# EAGLE schematic HFT-Core-Module_1V1 (EAGLE 7.7.0), part 2 of 2
## Sheet 25 of 37: I2C1 - LiPo charger
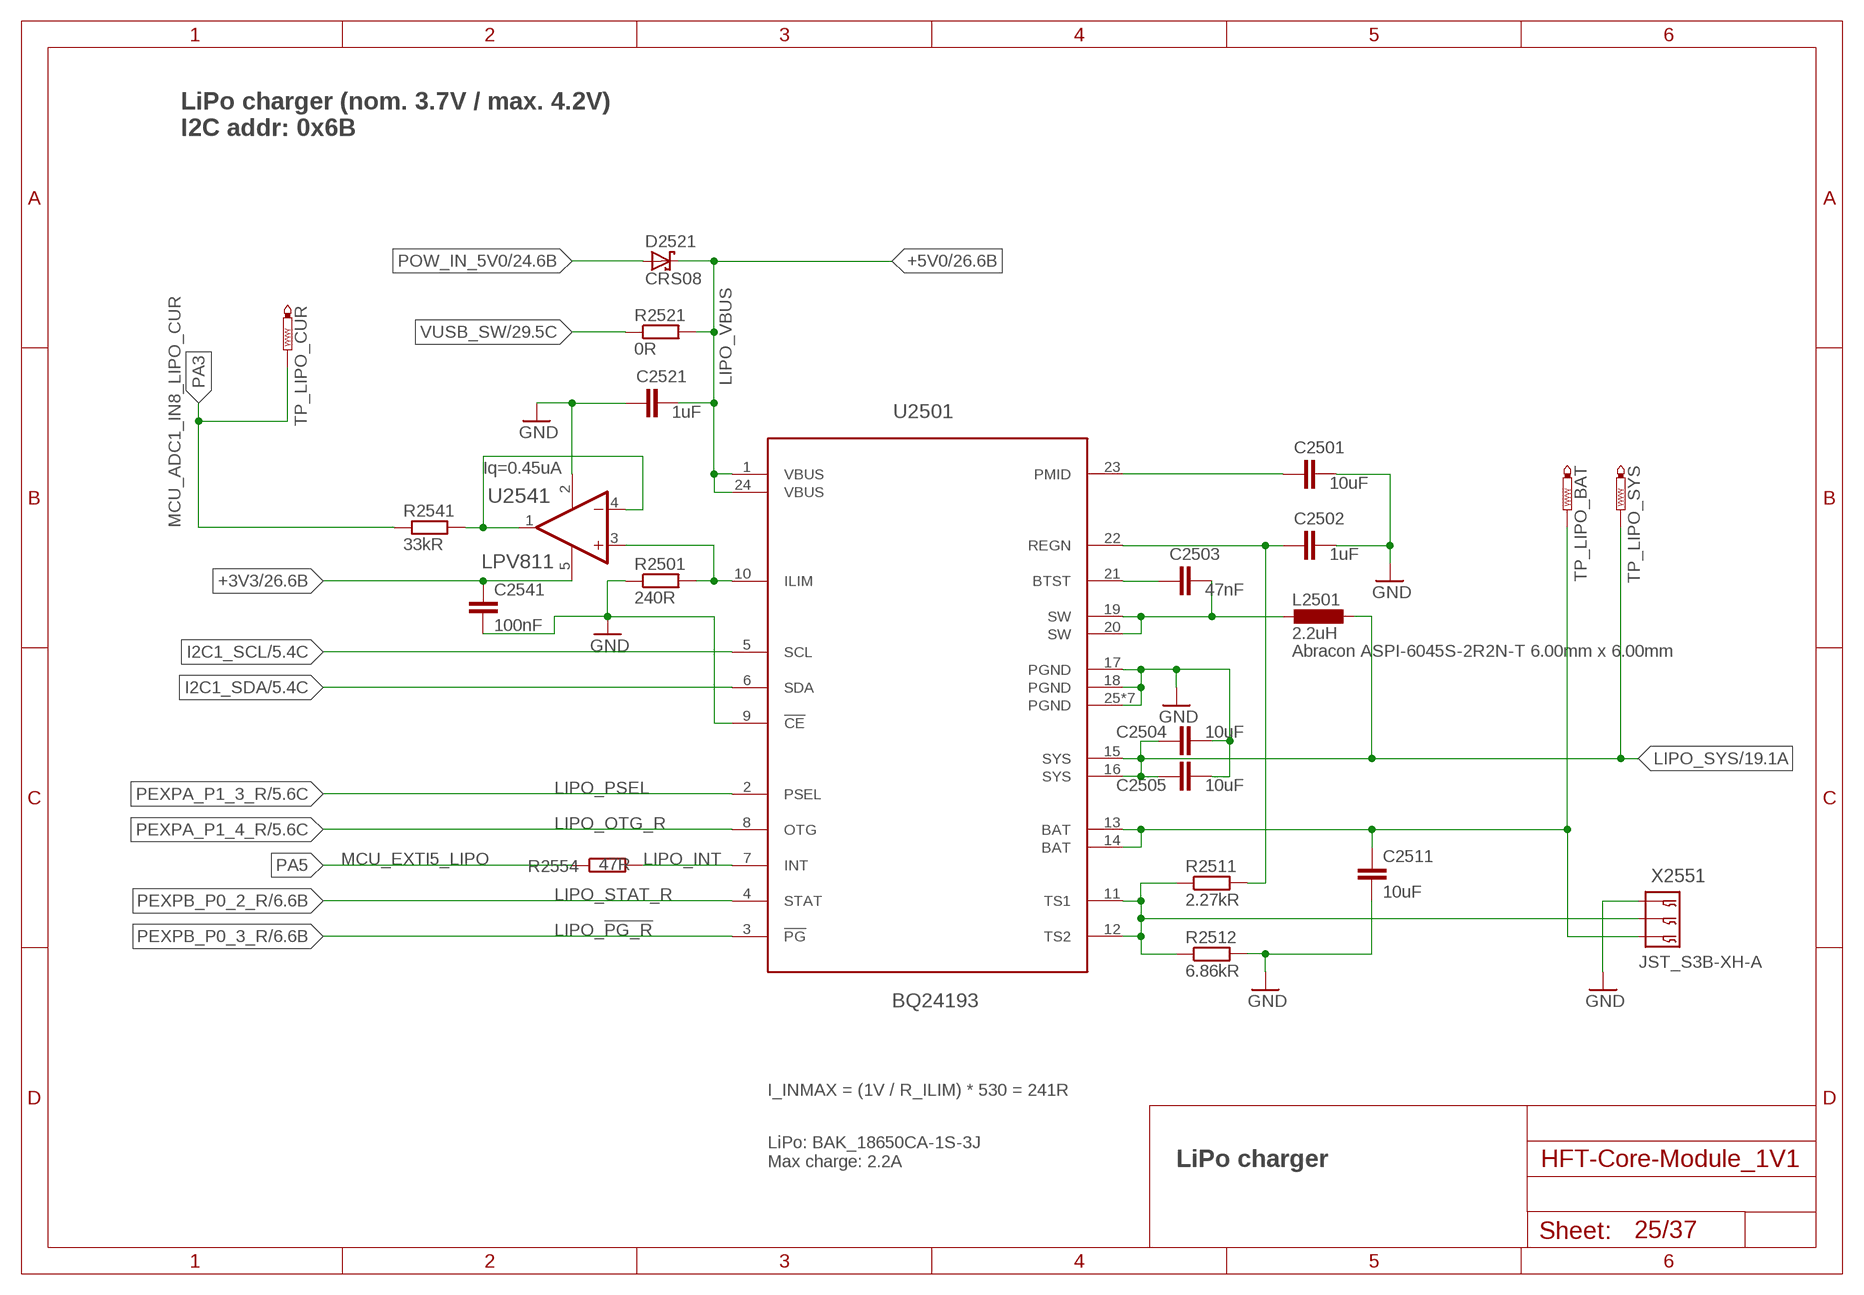
[diagram p24: schematic, sheet 25]

### Parts
C2501  10uF  C-EUC0402  [C0402]
C2502  1uF  C-EUC0402  [C0402]
C2503  47nF  C-EUC0402  [C0402]
C2504  10uF  C-EUC0402  [C0402]
C2505  10uF  C-EUC0402  [C0402]
C2511  10uF  C-EUC0402  [C0402]
C2521  1uF  C-EUC0402  [C0402]
C2541  100nF  C-EUC0402  [C0402]
D2521  CRS08  [SOD80C]
L2501  2.2uH  L-EU6.00X6.00MM  [L_6.00MM_X_6.00MM]
R2501  240R  R-EU_R0402  [R0402]
R2511  2.27kR  R-EU_R0402  [R0402]
R2512  6.86kR  R-EU_R0402  [R0402]
R2521  0R  R-EU_R0402  [R0402]
R2541  33kR  R-EU_R0402  [R0402]
R2554  47R  R-EU_R0402  [R0402]
TP_LIPO_BAT  PTR1B1,27  [B1,27]
TP_LIPO_CUR  PTR1B1,27  [B1,27]
TP_LIPO_SYS  PTR1B1,27  [B1,27]
U2501  BQ24193  [VQFN-24]
U2541  LPV811  [SOT-23-5]
X2551  JST_S3B-XH-A  [JST_S3B-XH-A]

### Nets
+3V3: C2541.1 U2541.5(V+) ; also sheet 2,4,5,6,7,8,9,10,11,13,14,15,22,23,26,27,28,30,31,34,36
+5V0 [pwrA5]: C2521.2 D2521.C R2521.2 U2501.1(VBUS) U2501.24(VBUS) ; also sheet 26,27,36
GND: C2501.2 C2502.2 C2504.2 C2505.2 C2511.2 C2521.1 C2541.2 R2501.1 R2512.2 U2501.9(!CE) U2501.17(PGND) U2501.18(PGND) U2501.25(PGND) U2501.26(PGND) U2501.P$1(PGND) U2501.P$2(PGND) U2501.P$3(PGND) U2501.P$4(PGND) U2501.P$5(PGND) U2541.2(V-) X2551.3 ; also sheet 1,2,3,4,5,6,7,8,9,10,11,12,13,14,15,16,17,18,19,21,22,23,24,26,27,28,29,30,31,32,33,34,35,36,37
I2C1_SCL: U2501.5(SCL) ; also sheet 5,6,8,10,14,15,16,17,18
I2C1_SDA: U2501.6(SDA) ; also sheet 5,6,8,10,14,15,16,17,18
LIPO_ADC_CUR_IN_LOOP: R2541.2 U2541.1(OUT) U2541.4(-IN)
LIPO_BAT: C2511.1 TP_LIPO_BAT.TP U2501.13(BAT) U2501.14(BAT) X2551.1
LIPO_BTST: C2503.1 U2501.21(BTST)
LIPO_ILIM: R2501.2 U2501.10(ILIM) U2541.3(+IN)
LIPO_INT: R2554.2 U2501.7(INT)
LIPO_PMID: C2501.1 U2501.23(PMID)
LIPO_REGN: C2502.1 R2511.2 U2501.22(REGN)
LIPO_SW: C2503.2 L2501.2 U2501.19(SW) U2501.20(SW)
LIPO_SYS: C2504.1 C2505.1 L2501.1 TP_LIPO_SYS.TP U2501.15(SYS) U2501.16(SYS) ; also sheet 19
LIPO_TS12: R2511.1 R2512.1 U2501.11(TS1) U2501.12(TS2) X2551.2
PA3: R2541.1 TP_LIPO_CUR.TP ; also sheet 1
PA5: R2554.1 ; also sheet 1
PEXPA_P1_3_R: U2501.2(PSEL) ; also sheet 5
PEXPA_P1_4_R: U2501.8(OTG) ; also sheet 5
PEXPB_P0_2_R: U2501.4(STAT) ; also sheet 6
PEXPB_P0_3_R: U2501.3(!PG) ; also sheet 6
POW_IN_5V0: D2521.A ; also sheet 24
VUSB_SW [pwrA5]: R2521.1 ; also sheet 29

### Notes on the sheet
- LiPo charger (nom. 3.7V / max. 4.2V)
  I2C addr: 0x6B
- LIPO_VBUS
- Iq=0.45uA
- MCU_ADC1_IN8_LIPO_CUR
- Abracon ASPI-6045S-2R2N-T 6.00mm x 6.00mm
- LIPO_PSEL
- LIPO_OTG_R
- MCU_EXTI5_LIPO
- LIPO_STAT_R
- LIPO_!PG_R
- I_INMAX = (1V / R_ILIM) * 530 = 241R
- LiPo: BAK_18650CA-1S-3J
  Max charge: 2.2A
- LiPo charger

## Sheet 26 of 37: ADC1/TIMCAP - Solar Power Harvesting
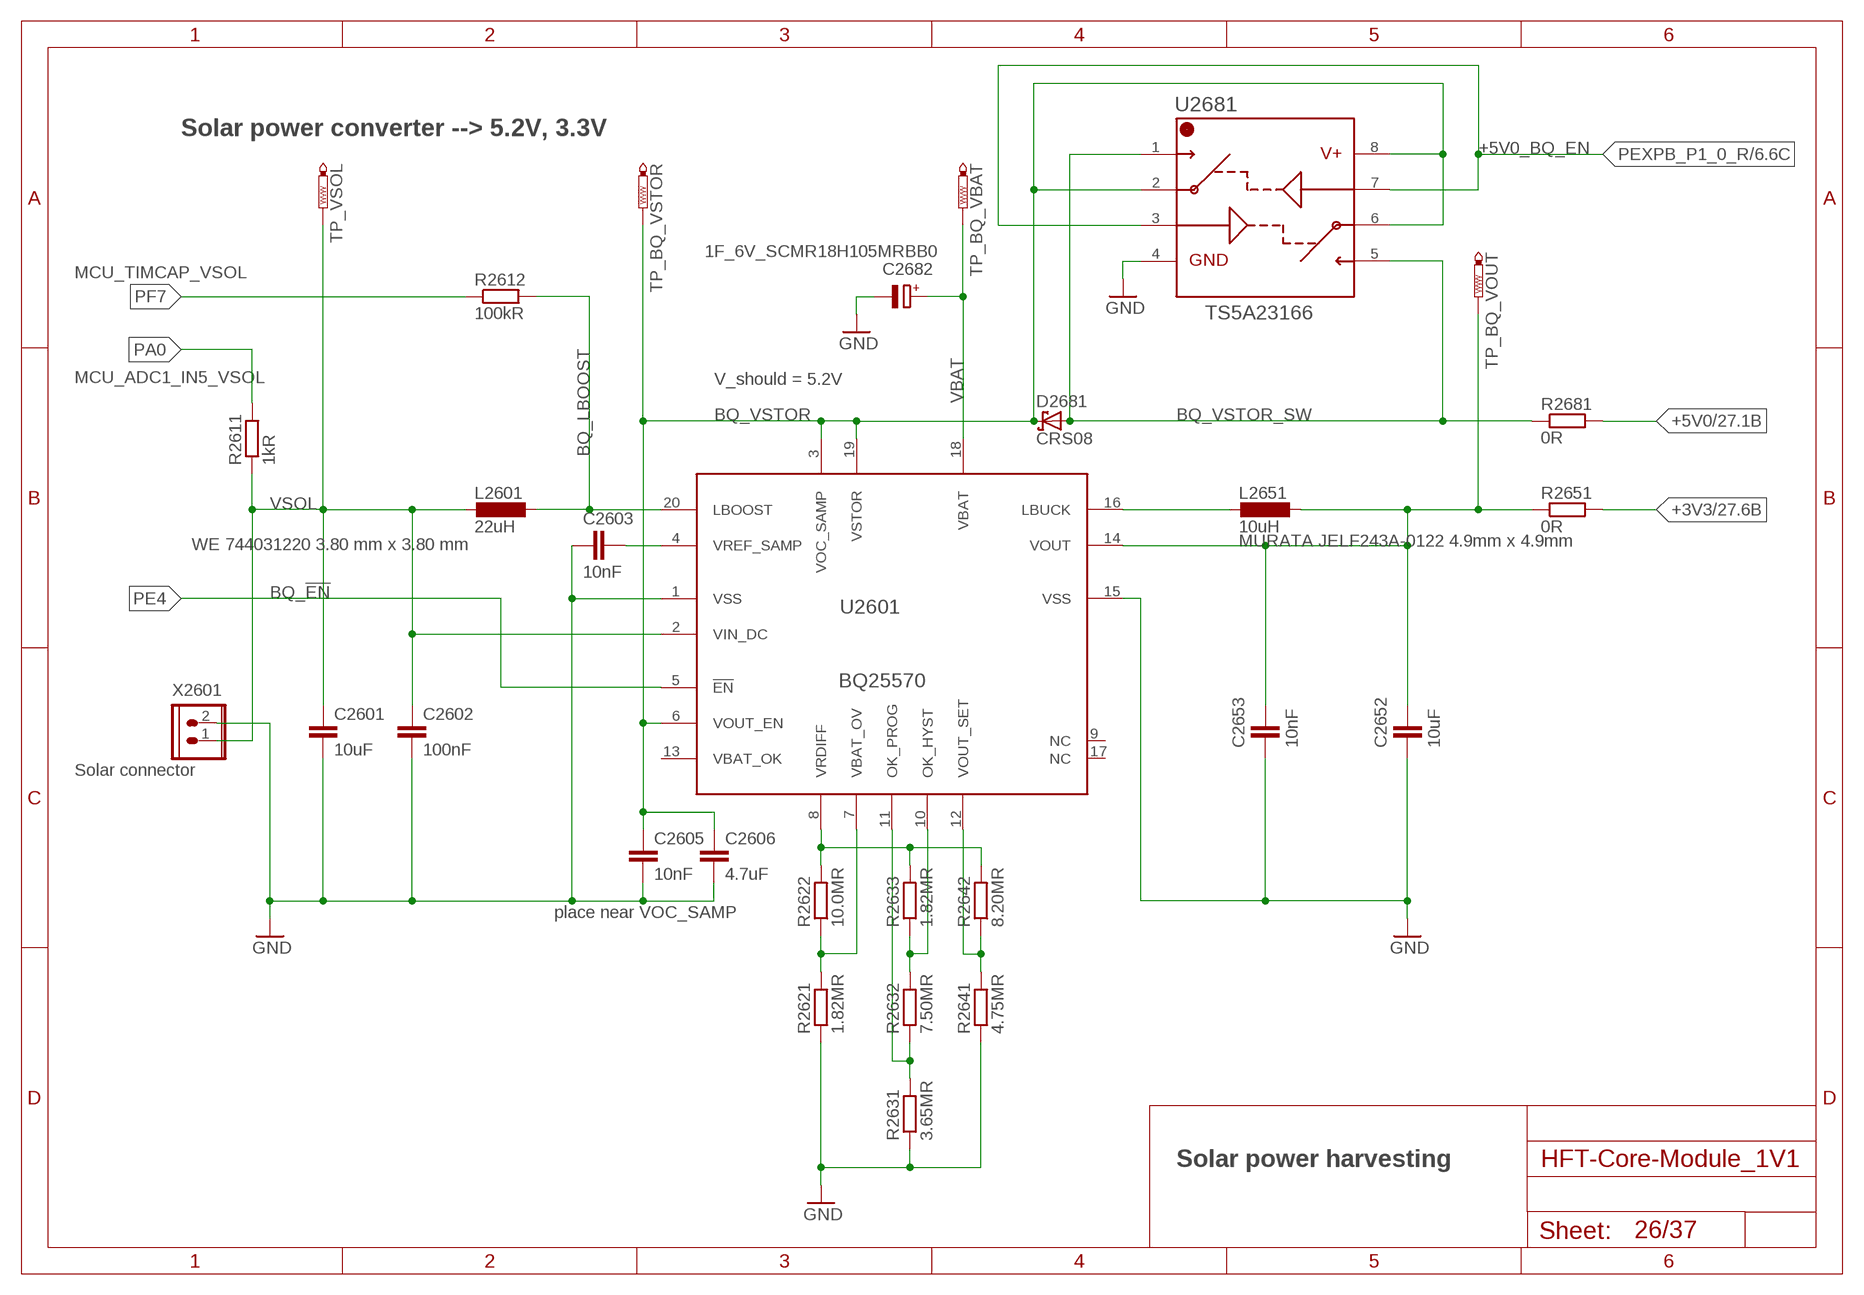
[diagram p25: schematic, sheet 26]

### Parts
C2601  10uF  C-EUC0402  [C0402]
C2602  100nF  C-EUC0402  [C0402]
C2603  10nF  C-EUC0402  [C0402]
C2605  10nF  C-EUC0402  [C0402]
C2606  4.7uF  C-EUC0402  [C0402]
C2652  10uF  C-EUC0402  [C0402]
C2653  10nF  C-EUC0402  [C0402]
C2682  1F_6V_SCMR18H105MRBB0  CPOL-EUC115-080X160_POL  [C115-080X160_POL]
D2681  CRS08  [SOD80C]
L2601  22uH  L-EUWE-TPCWE_TPC_3MM8  [WE-TPC_3MM8-3MM8_R-1MM3]
L2651  10uH  L-EU4.90X4.90MM  [L_4.90MM_X_4.90MM]
R2611  1kR  R-EU_R0402  [R0402]
R2612  100kR  R-EU_R0402  [R0402]
R2621  1.82MR  R-EU_R0402  [R0402]
R2622  10.0MR  R-EU_R0402  [R0402]
R2631  3.65MR  R-EU_R0402  [R0402]
R2632  7.50MR  R-EU_R0402  [R0402]
R2633  1.82MR  R-EU_R0402  [R0402]
R2641  4.75MR  R-EU_R0402  [R0402]
R2642  8.20MR  R-EU_R0402  [R0402]
R2651  0R  R-EU_R0402  [R0402]
R2681  0R  R-EU_R0402  [R0402]
TP_BQ_VBAT  PTR1B1,27  [B1,27]
TP_BQ_VOUT  PTR1B1,27  [B1,27]
TP_BQ_VSTOR  PTR1B1,27  [B1,27]
TP_VSOL  PTR1B1,27  [B1,27]
U2601  BQ25570  [V-PVQFN-20]
U2681  TS5A23166  [R-PDSO-G8]
X2601  WIRE-TO-BOARD_5MM08_1X02  [WIRE-TO-BOARD_5MM08_1X02]

### Nets
+3V3: R2651.2 ; also sheet 2,4,5,6,7,8,9,10,11,13,14,15,22,23,25,27,28,30,31,34,36
+5V0 [pwrA5]: R2681.2 ; also sheet 25,27,36
BQ_LBOOST: L2601.1 R2612.2 U2601.20(LBOOST)
BQ_LBUCK: L2651.2 U2601.16(LBUCK)
BQ_OK_HYST: R2632.2 R2633.1 U2601.10(OK_HYST)
BQ_OK_PROG: R2631.2 R2632.1 U2601.11(OK_PROG)
BQ_VBAT_OV: R2621.2 R2622.1 U2601.7(VBAT_OV)
BQ_VOUT: C2652.1 C2653.1 L2651.1 R2651.1 TP_BQ_VOUT.TP U2601.14(VOUT)
BQ_VOUT_SET: R2641.2 R2642.1 U2601.12(VOUT_SET)
BQ_VRDIFF: R2622.2 R2633.2 R2642.2 U2601.8(VRDIFF)
BQ_VREF_SAMP: C2603.2 U2601.4(VREF_SAMP)
BQ_VSTOR: C2605.1 C2606.1 D2681.C TP_BQ_VSTOR.TP U2601.3(VOC_SAMP) U2601.6(VOUT_EN) U2601.19(VSTOR) U2681.2 U2681.6 U2681.8
BQ_VSTOR_SW: D2681.A R2681.1 U2681.1 U2681.5
GND: C2601.2 C2602.2 C2603.1 C2605.2 C2606.2 C2652.2 C2653.2 C2682.- R2621.1 R2631.1 R2641.1 U2601.1(VSS) U2601.15(VSS) U2681.4 X2601.2 ; also sheet 1,2,3,4,5,6,7,8,9,10,11,12,13,14,15,16,17,18,19,21,22,23,24,25,27,28,29,30,31,32,33,34,35,36,37
PA0: R2611.2 ; also sheet 1
PE4: U2601.5(!EN) ; also sheet 1
PEXPB_P1_0_R: U2681.3 U2681.7 ; also sheet 6
PF7: R2612.1 ; also sheet 1
VBAT: C2682.+ TP_BQ_VBAT.TP U2601.18(VBAT)
VSOL: C2601.1 C2602.1 L2601.2 R2611.1 TP_VSOL.TP U2601.2(VIN_DC) X2601.1
Unconnected: U2601.9(NC) U2601.13(VBAT_OK) U2601.17(NC)

### Notes on the sheet
- Solar power converter --> 5.2V, 3.3V
- +5V0_BQ_EN
- MCU_TIMCAP_VSOL
- MCU_ADC1_IN5_VSOL | V_should = 5.2V
- WE 744031220 3.80 mm x 3.80 mm | MURATA JELF243A-0122 4.9mm x 4.9mm
- BQ_!EN
- Solar connector
- place near VOC_SAMP
- Solar power harvesting

## Sheet 27 of 37: PMIC 5V --> 3V3
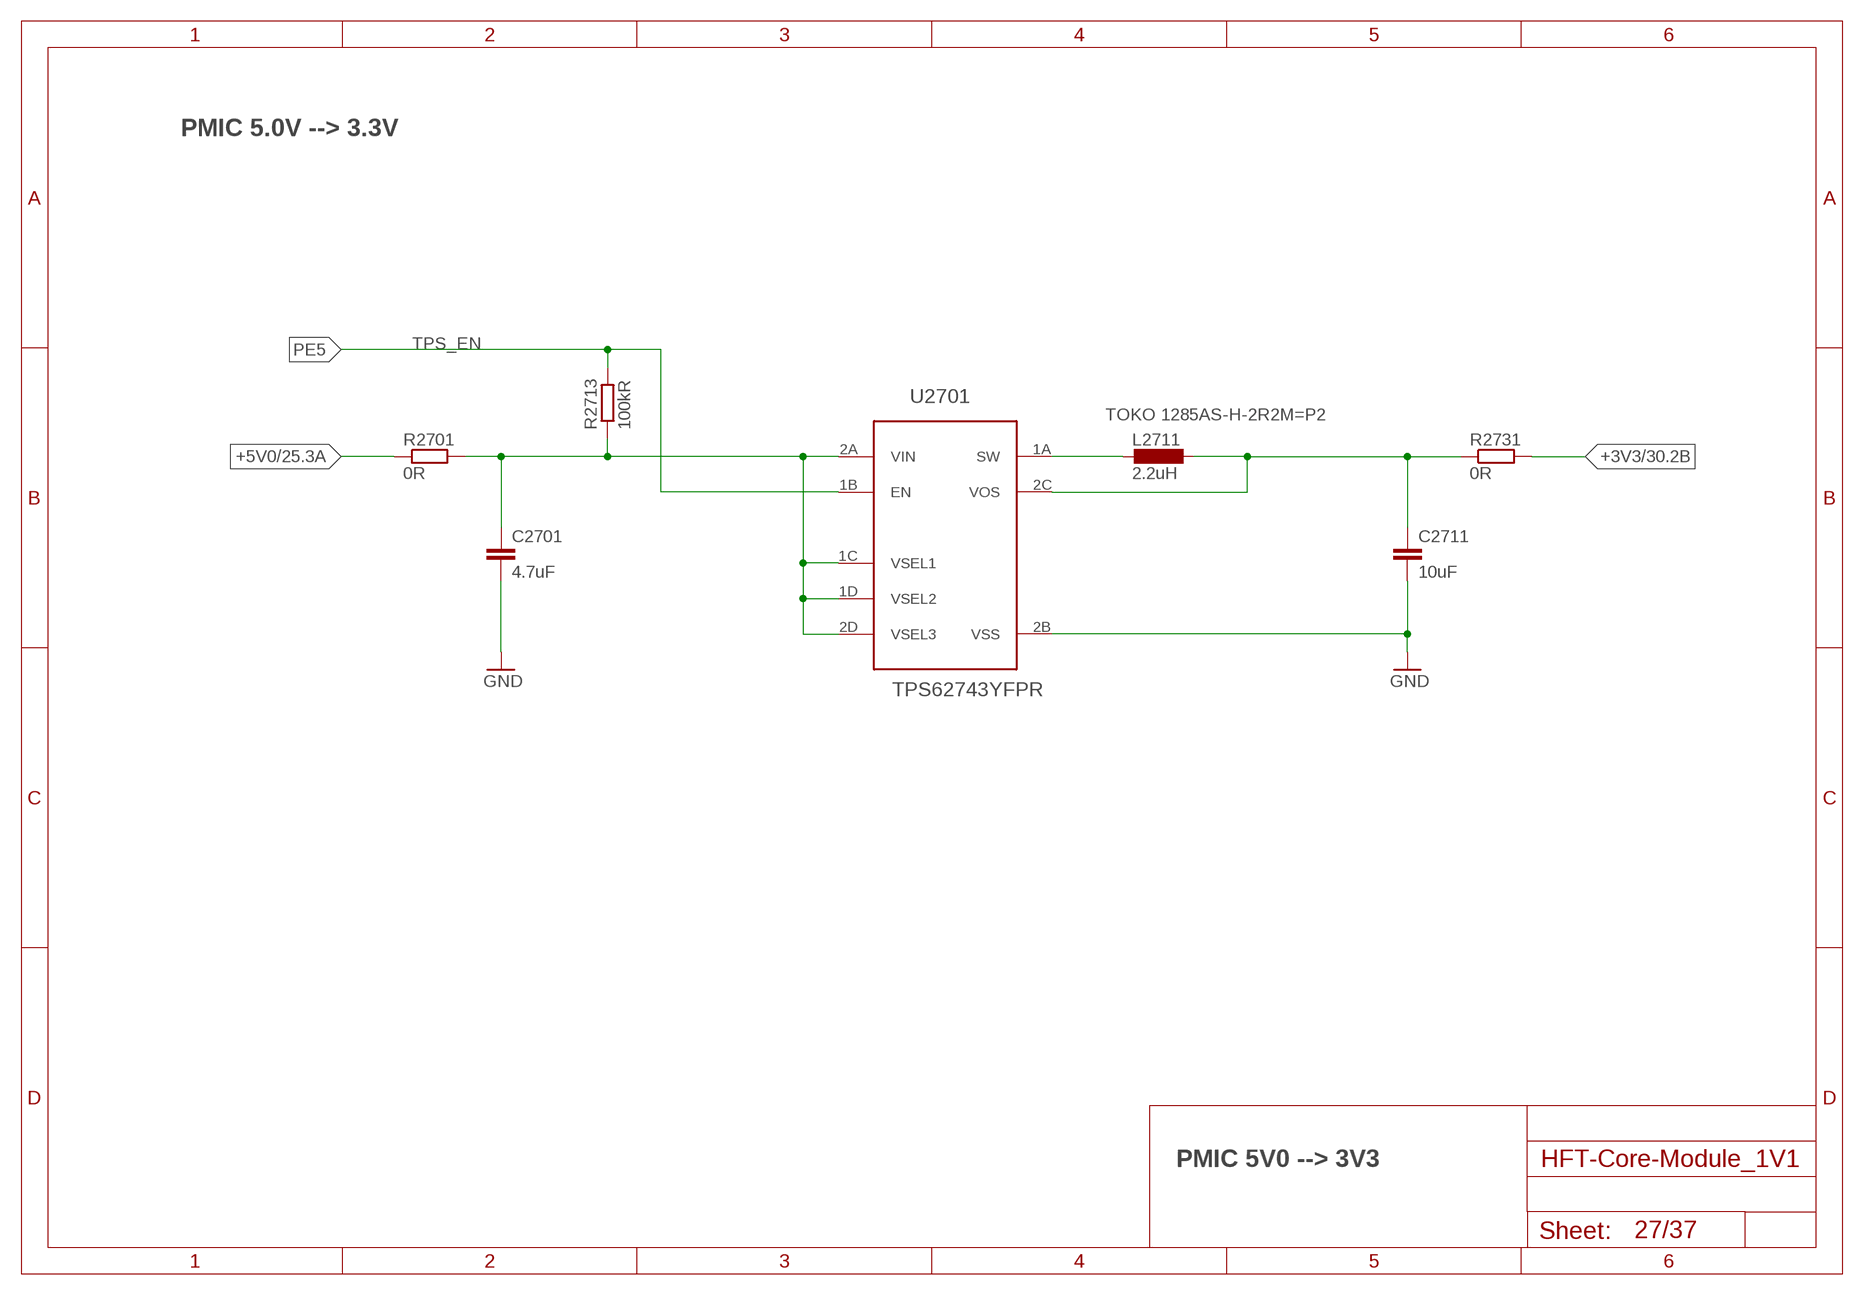
[diagram p26: schematic, sheet 27]

### Parts
C2701  4.7uF  C-EUC0603  [C0603]
C2711  10uF  C-EUC0603  [C0603]
L2711  2.2uH  L-EU4.50X3.20MM  [L_4.50MM_X_3.20MM]
R2701  0R  R-EU_R0402  [R0402]
R2713  100kR  R-EU_R0402  [R0402]
R2731  0R  R-EU_R0402  [R0402]
U2701  TPS62743YFPR  TPS62743  [WCSP-8]

### Nets
+3V3: R2731.2 ; also sheet 2,4,5,6,7,8,9,10,11,13,14,15,22,23,25,26,28,30,31,34,36
+5V0 [pwrA5]: R2701.1 ; also sheet 25,26,36
GND: C2701.2 C2711.2 U2701.2B(VSS) ; also sheet 1,2,3,4,5,6,7,8,9,10,11,12,13,14,15,16,17,18,19,21,22,23,24,25,26,28,29,30,31,32,33,34,35,36,37
PE5: R2713.2 U2701.1B(EN) ; also sheet 1
TPS_SW: L2711.2 L2711.4 U2701.1A(SW)
TPS_VIN [pwrA5]: C2701.1 R2701.2 R2713.1 U2701.1C(VSEL1) U2701.1D(VSEL2) U2701.2A(VIN) U2701.2D(VSEL3)
TPS_VOUT: C2711.1 L2711.1 L2711.3 R2731.1 U2701.2C(VOS)

### Notes on the sheet
- PMIC 5.0V --> 3.3V
- TPS_EN
- TOKO 1285AS-H-2R2M=P2
- PMIC 5V0 --> 3V3

## Sheet 28 of 37: I2C1 - PMIC 3.3V -> 1.2V
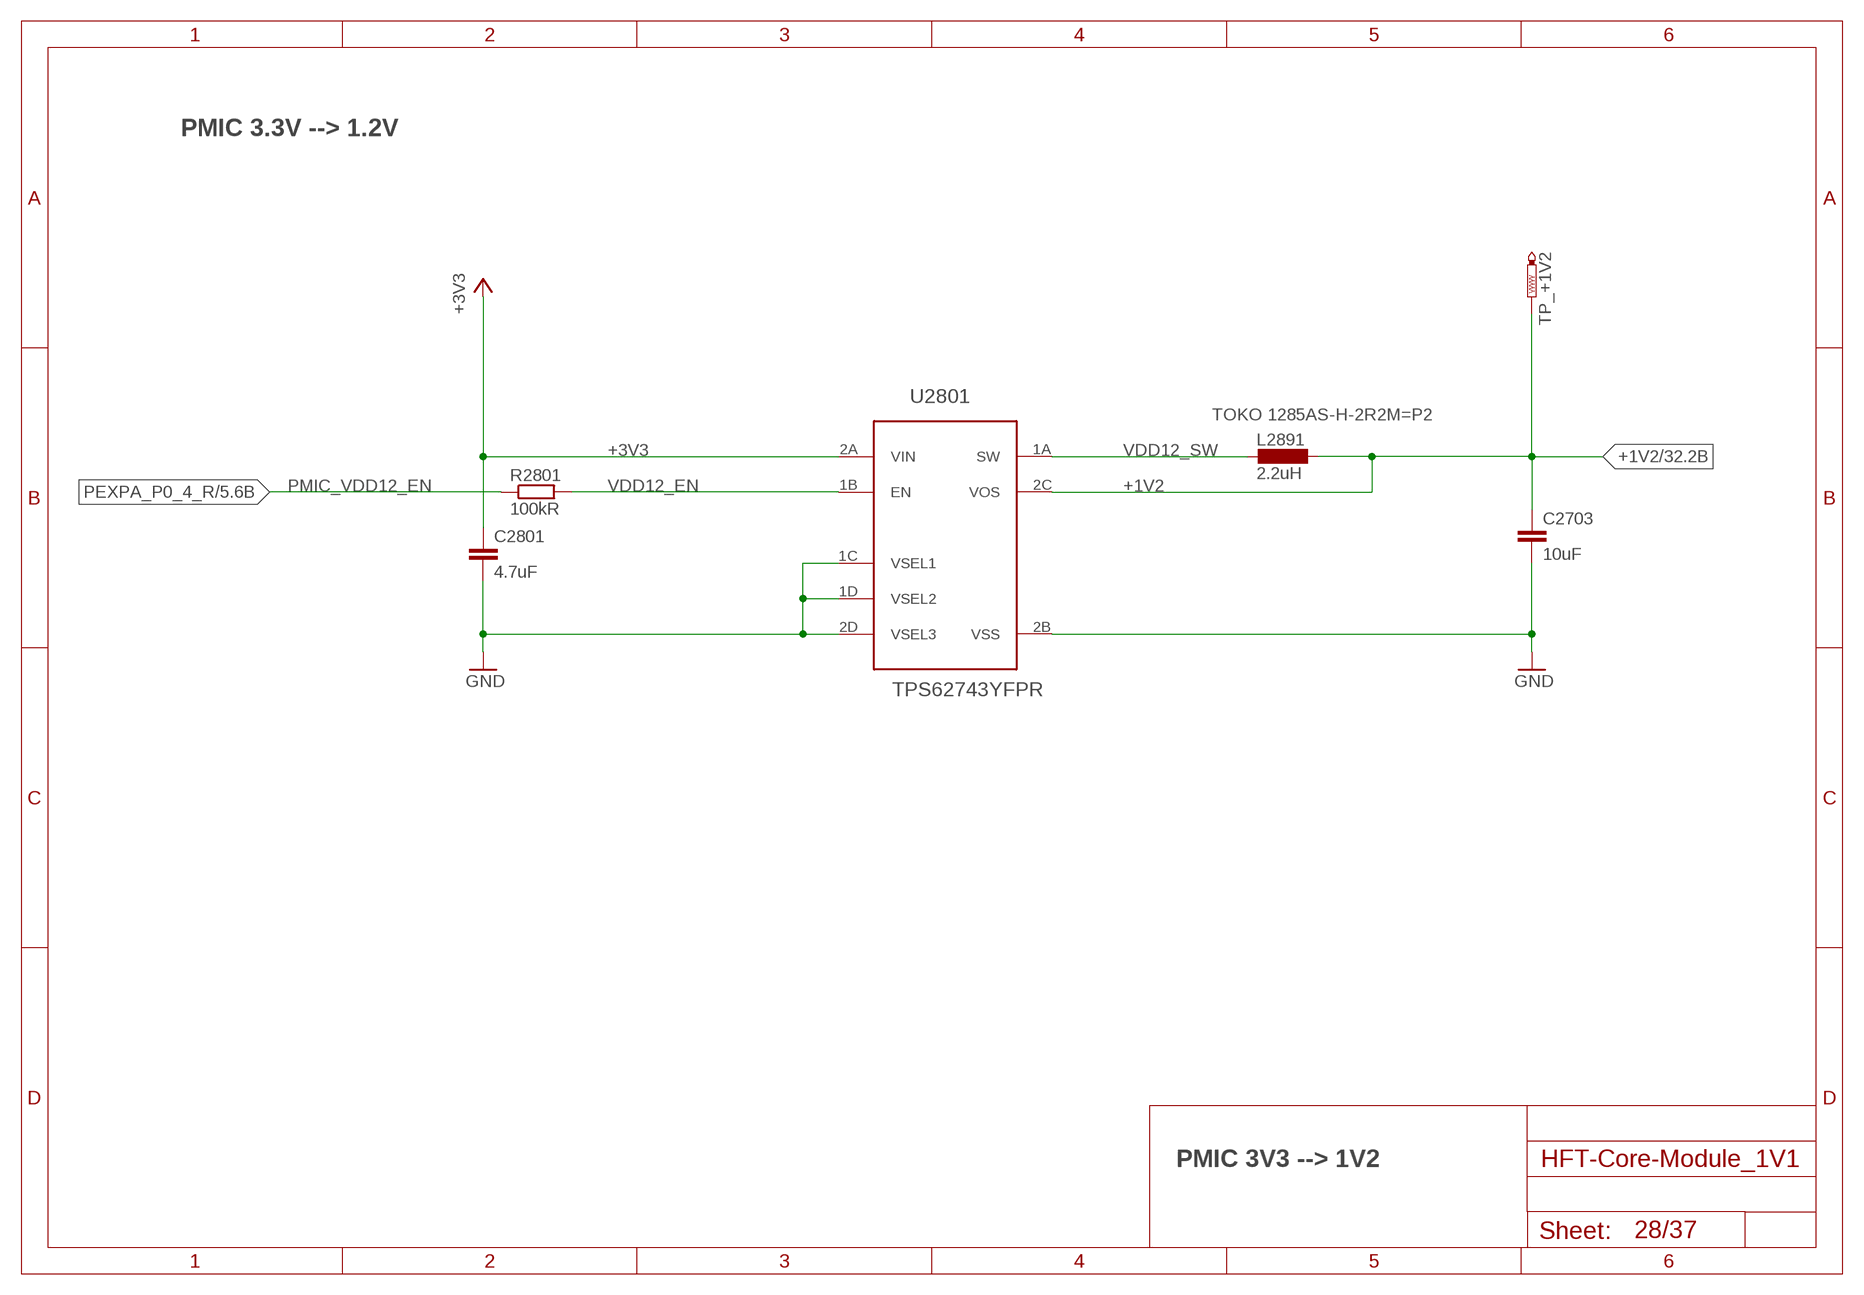
[diagram p27: schematic, sheet 28]

### Parts
C2703  10uF  C-EUC0402  [C0402]
C2801  4.7uF  C-EUC0402  [C0402]
L2891  2.2uH  L-EU4.90X4.90MM  [L_4.90MM_X_4.90MM]
R2801  100kR  R-EU_R0402  [R0402]
TP_+1V2  PTR1B1,27  [B1,27]
U2801  TPS62743YFPR  TPS62743  [WCSP-8]

### Nets
+1V2: C2703.1 L2891.1 TP_+1V2.TP U2801.2C(VOS) ; also sheet 32
+3V3: C2801.1 U2801.2A(VIN) ; also sheet 2,4,5,6,7,8,9,10,11,13,14,15,22,23,25,26,27,30,31,34,36
GND: C2703.2 C2801.2 U2801.1C(VSEL1) U2801.1D(VSEL2) U2801.2B(VSS) U2801.2D(VSEL3) ; also sheet 1,2,3,4,5,6,7,8,9,10,11,12,13,14,15,16,17,18,19,21,22,23,24,25,26,27,29,30,31,32,33,34,35,36,37
PEXPA_P0_4_R: R2801.1 ; also sheet 5
VDD12_EN: R2801.2 U2801.1B(EN)
VDD12_SW: L2891.2 U2801.1A(SW)

### Notes on the sheet
- PMIC 3.3V --> 1.2V
- TOKO 1285AS-H-2R2M=P2
- PMIC_VDD12_EN
- PMIC 3V3 --> 1V2

## Sheet 29 of 37: Switch: VUSB --> LiPo charger
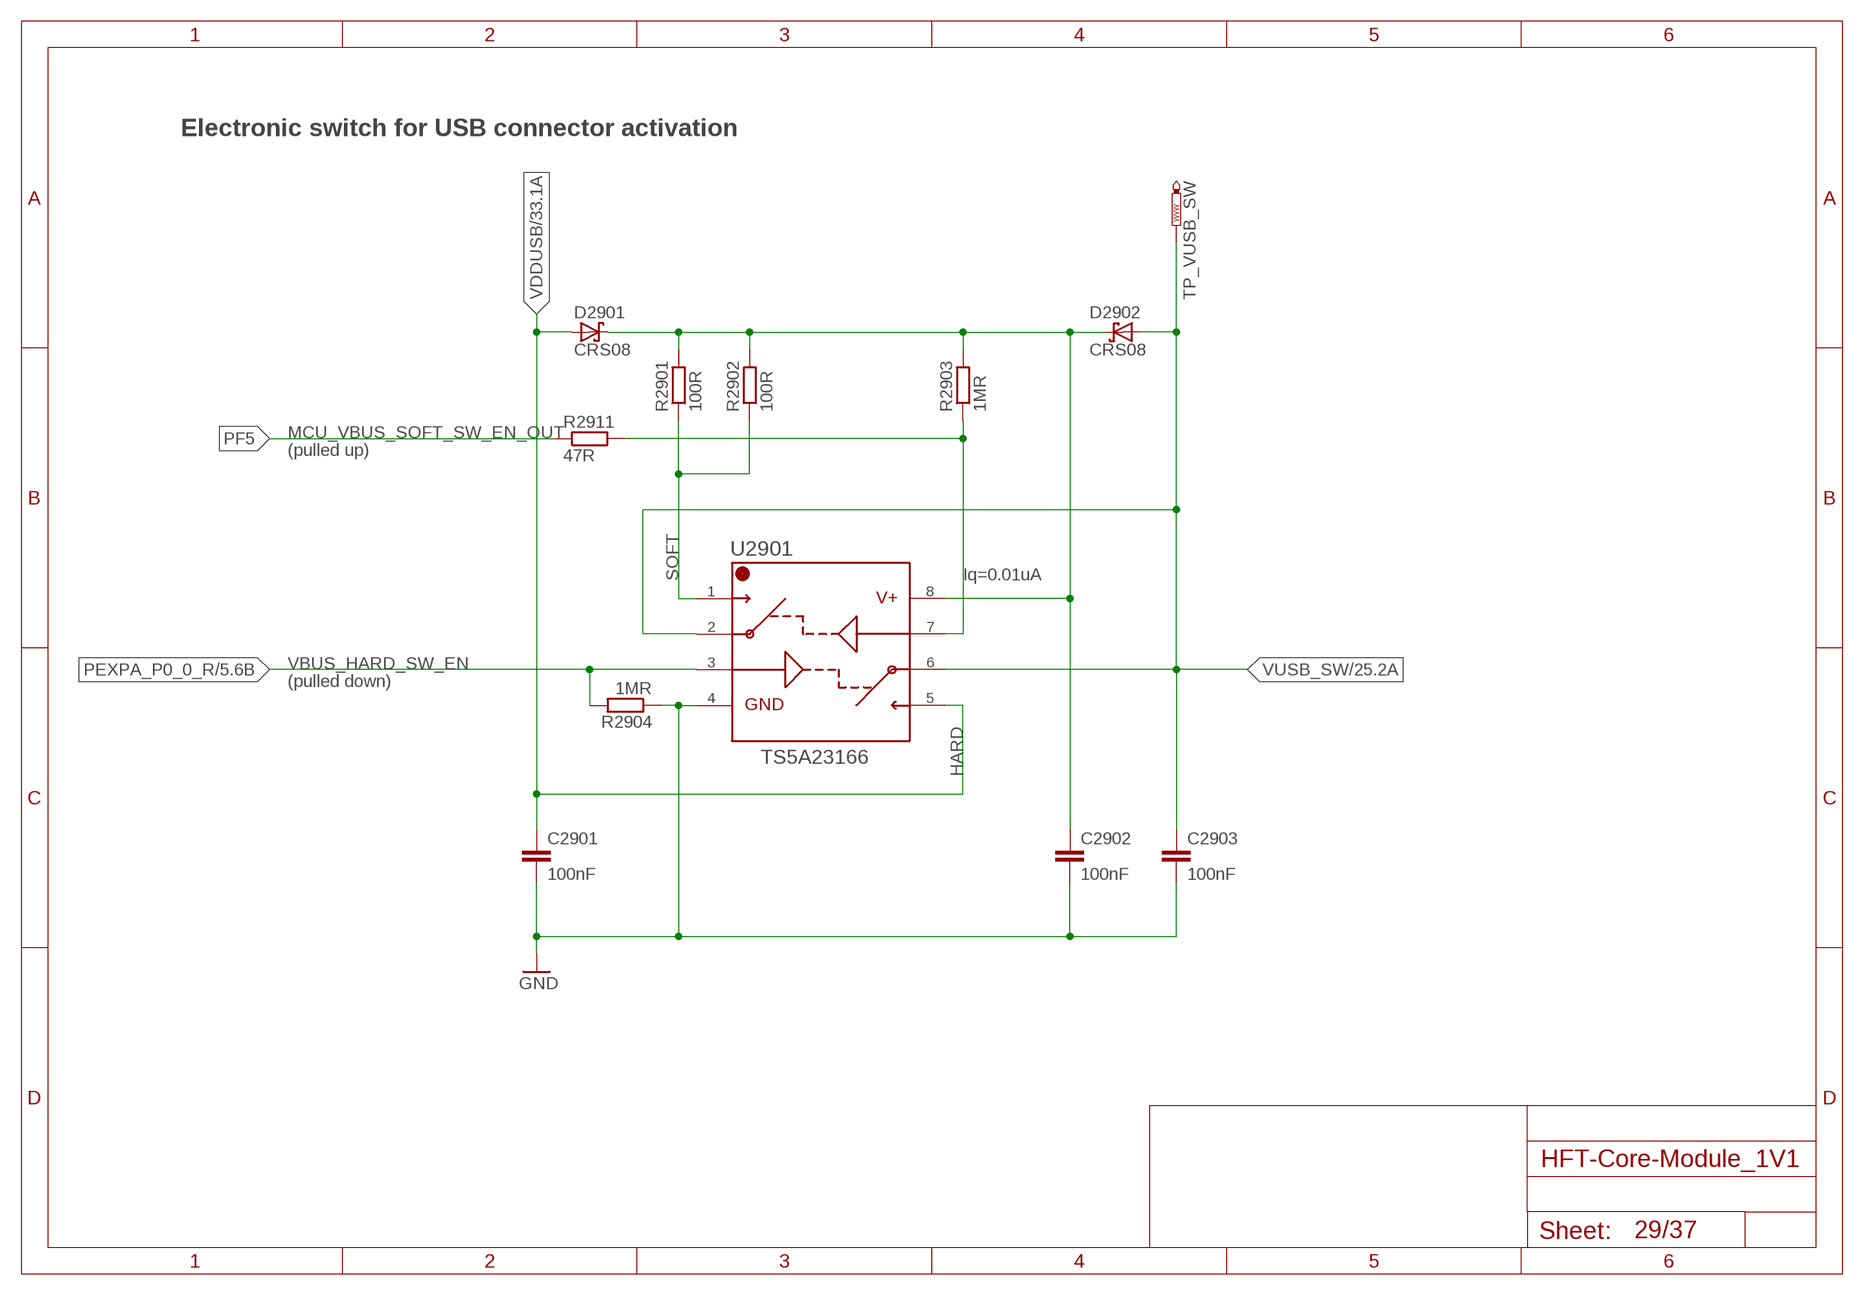
[diagram p28: schematic, sheet 29]

### Parts
C2901  100nF  C-EUC0402  [C0402]
C2902  100nF  C-EUC0402  [C0402]
C2903  100nF  C-EUC0402  [C0402]
D2901  CRS08  [SOD80C]
D2902  CRS08  [SOD80C]
R2901  100R  R-EU_R0402  [R0402]
R2902  100R  R-EU_R0402  [R0402]
R2903  1MR  R-EU_R0402  [R0402]
R2904  1MR  R-EU_R0402  [R0402]
R2911  47R  R-EU_R0402  [R0402]
TP_VUSB_SW  PTR1B1,27  [B1,27]
U2901  TS5A23166  [R-PDSO-G8]

### Nets
GND: C2901.2 C2902.2 C2903.2 R2904.1 U2901.4 ; also sheet 1,2,3,4,5,6,7,8,9,10,11,12,13,14,15,16,17,18,19,21,22,23,24,25,26,27,28,30,31,32,33,34,35,36,37
MCU_VBUS_SOFT_SW_EN_OUT_R: R2903.1 R2911.2 U2901.7
PEXPA_P0_0_R: R2904.2 U2901.3 ; also sheet 5
PF5: R2911.1 ; also sheet 1
VDDUSB: C2901.1 D2901.A U2901.5 ; also sheet 1,33
VDDUSB_DK: C2902.1 D2901.C D2902.C R2901.2 R2902.2 R2903.2 U2901.8
VDDUSB_SOFT: R2901.1 R2902.1 U2901.1
VUSB_SW [pwrA5]: C2903.1 D2902.A TP_VUSB_SW.TP U2901.2 U2901.6 ; also sheet 25

### Notes on the sheet
- Electronic switch for USB connector activation
- MCU_VBUS_SOFT_SW_EN_OUT
- (pulled up)
- SOFT | Iq=0.01uA
- VBUS_HARD_SW_EN
- (pulled down)
- HARD

## Sheet 30 of 37: Switch: 3.3V -> 3.3V_XO _PA
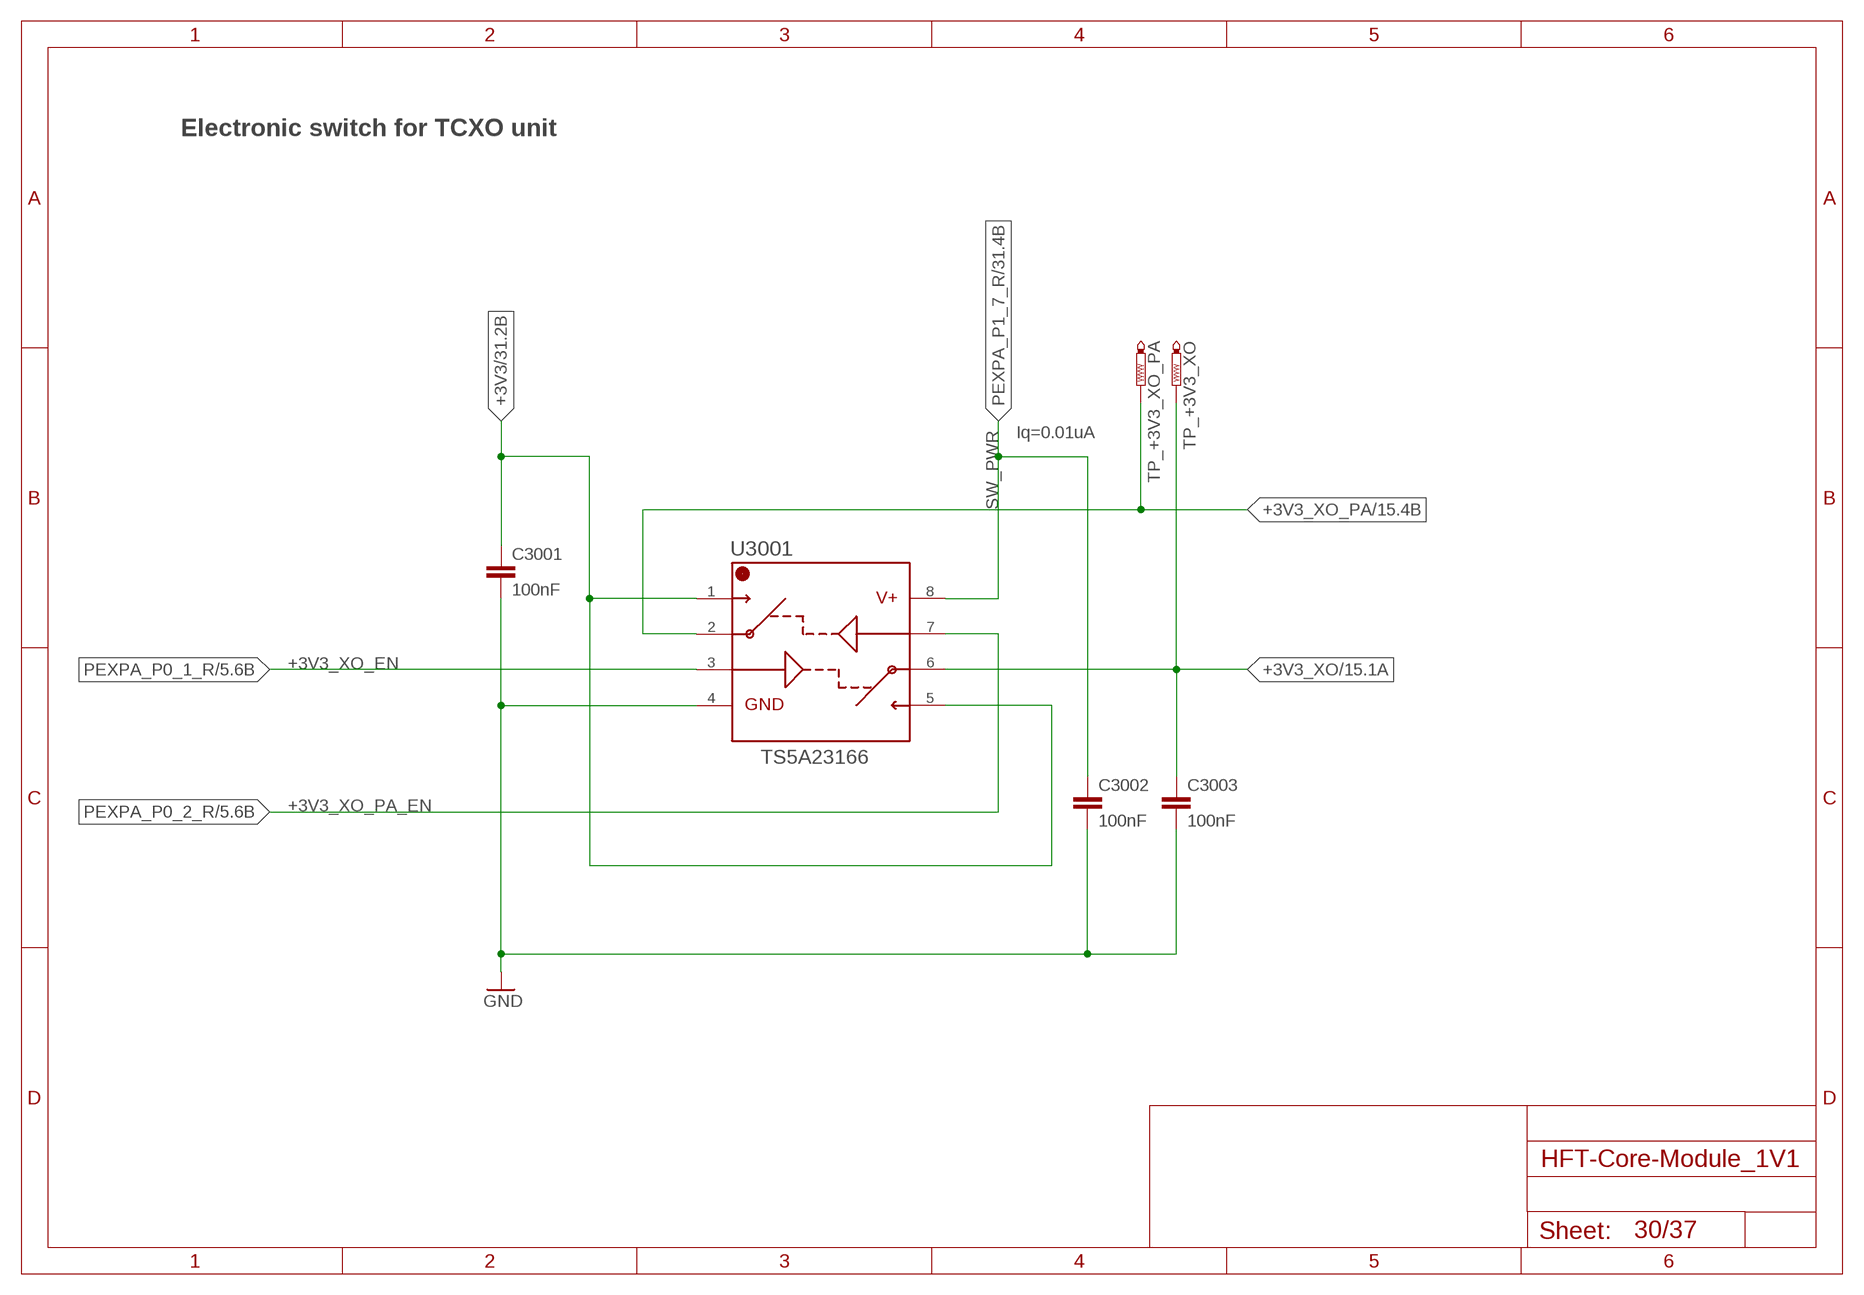
[diagram p29: schematic, sheet 30]

### Parts
C3001  100nF  C-EUC0402  [C0402]
C3002  100nF  C-EUC0402  [C0402]
C3003  100nF  C-EUC0402  [C0402]
TP_+3V3_XO  PTR1B1,27  [B1,27]
TP_+3V3_XO_PA  PTR1B1,27  [B1,27]
U3001  TS5A23166  [R-PDSO-G8]

### Nets
+3V3: C3001.1 U3001.1 U3001.5 ; also sheet 2,4,5,6,7,8,9,10,11,13,14,15,22,23,25,26,27,28,31,34,36
+3V3_XO: C3003.1 TP_+3V3_XO.TP U3001.6 ; also sheet 15
+3V3_XO_PA: TP_+3V3_XO_PA.TP U3001.2 ; also sheet 15
GND: C3001.2 C3002.2 C3003.2 U3001.4 ; also sheet 1,2,3,4,5,6,7,8,9,10,11,12,13,14,15,16,17,18,19,21,22,23,24,25,26,27,28,29,31,32,33,34,35,36,37
PEXPA_P0_1_R: U3001.3 ; also sheet 5
PEXPA_P0_2_R: U3001.7 ; also sheet 5
PEXPA_P1_7_R: C3002.1 U3001.8 ; also sheet 5,16,31,32,34

### Notes on the sheet
- Electronic switch for TCXO unit
- Iq=0.01uA
- SW_PWR
- +3V3_XO_EN
- +3V3_XO_PA_EN

## Sheet 31 of 37: Switch: 3.3V -> 3.3V_High-Current
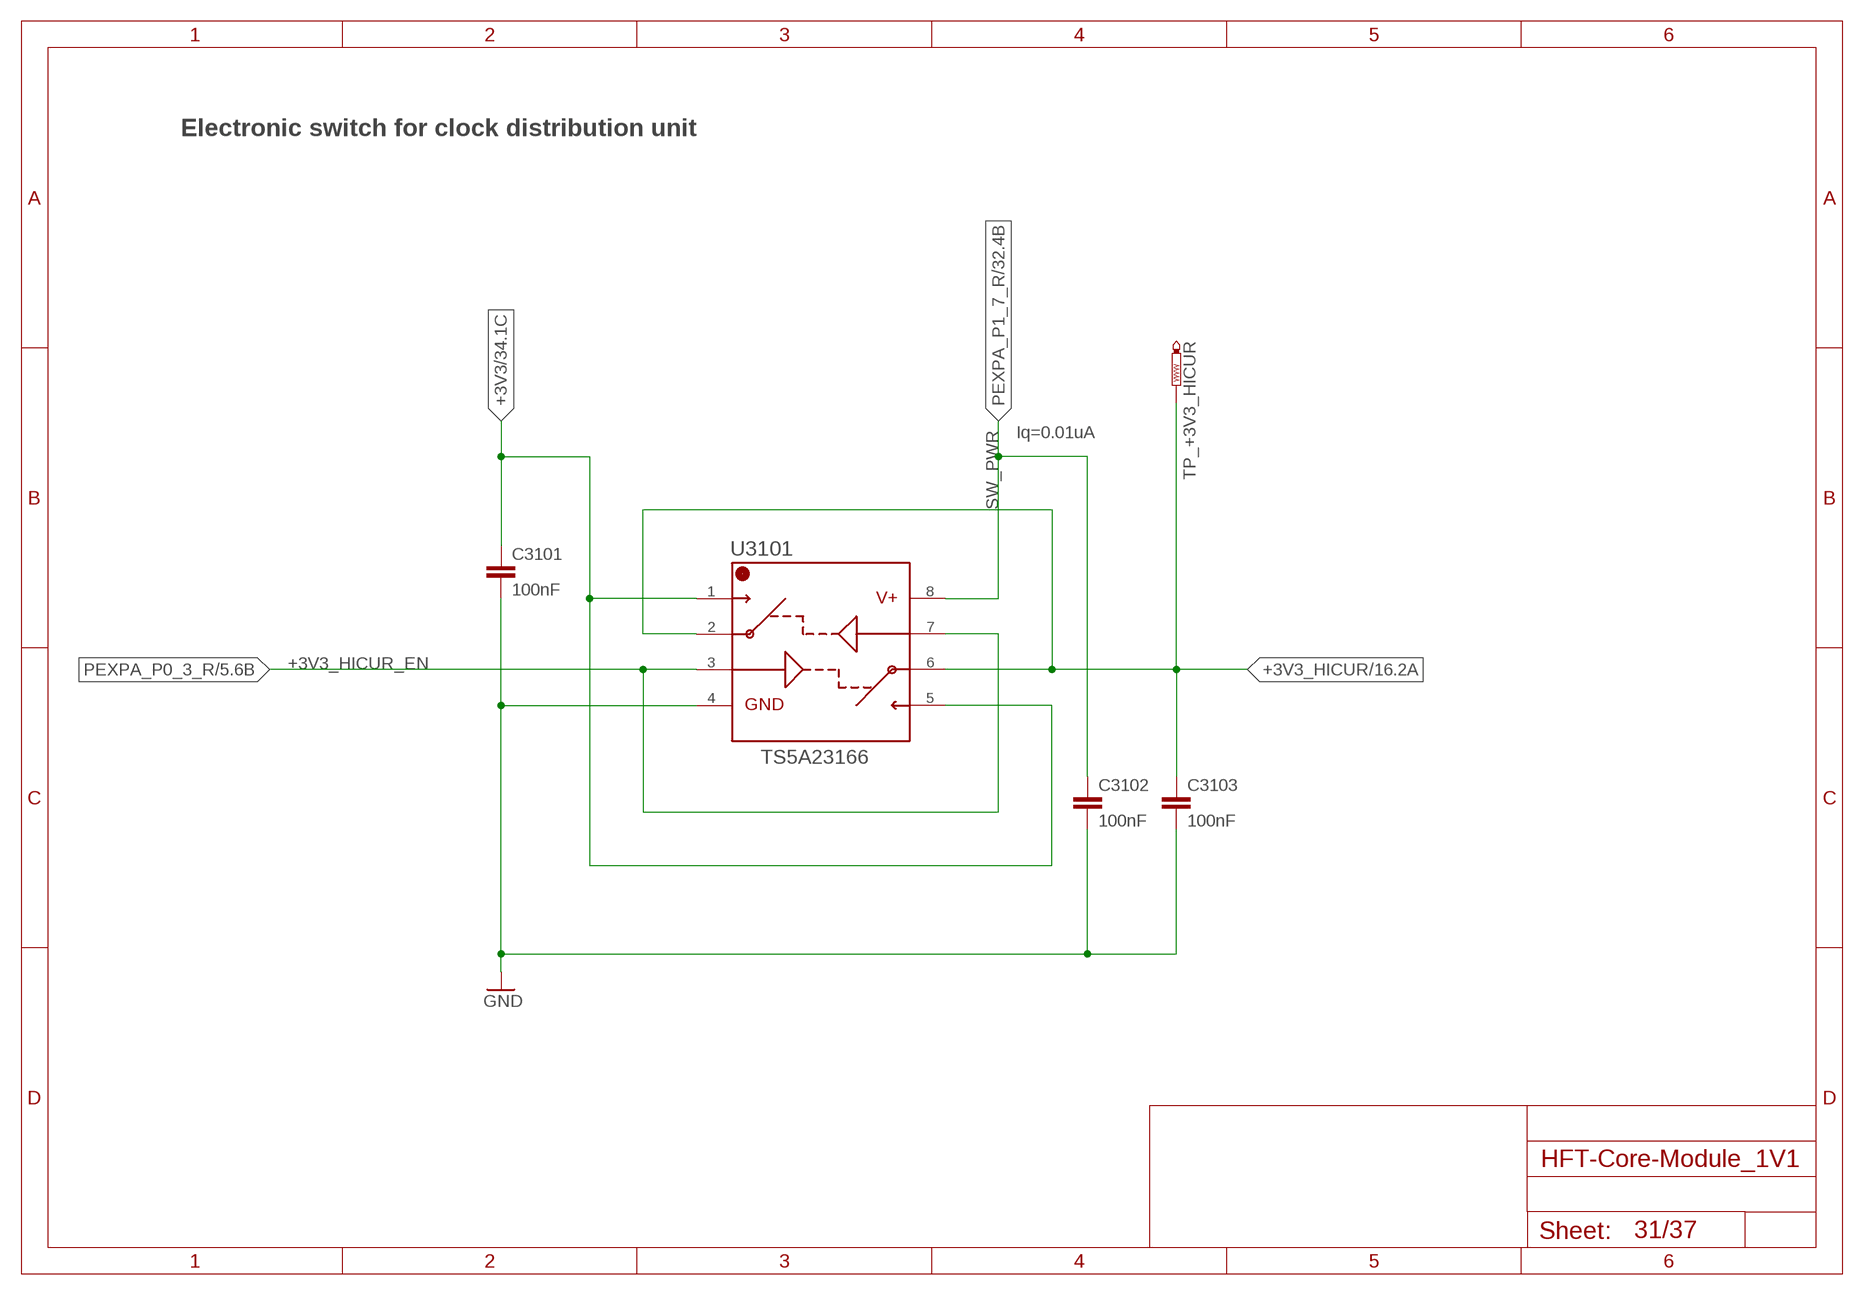
[diagram p30: schematic, sheet 31]

### Parts
C3101  100nF  C-EUC0402  [C0402]
C3102  100nF  C-EUC0402  [C0402]
C3103  100nF  C-EUC0402  [C0402]
TP_+3V3_HICUR  PTR1B1,27  [B1,27]
U3101  TS5A23166  [R-PDSO-G8]

### Nets
+3V3: C3101.1 U3101.1 U3101.5 ; also sheet 2,4,5,6,7,8,9,10,11,13,14,15,22,23,25,26,27,28,30,34,36
+3V3_HICUR: C3103.1 TP_+3V3_HICUR.TP U3101.2 U3101.6 ; also sheet 16,17,18
GND: C3101.2 C3102.2 C3103.2 U3101.4 ; also sheet 1,2,3,4,5,6,7,8,9,10,11,12,13,14,15,16,17,18,19,21,22,23,24,25,26,27,28,29,30,32,33,34,35,36,37
PEXPA_P0_3_R: U3101.3 U3101.7 ; also sheet 5
PEXPA_P1_7_R: C3102.1 U3101.8 ; also sheet 5,16,30,32,34

### Notes on the sheet
- Electronic switch for clock distribution unit
- Iq=0.01uA
- SW_PWR
- +3V3_HICUR_EN

## Sheet 32 of 37: Switch SMTP 1.2V -> MCU
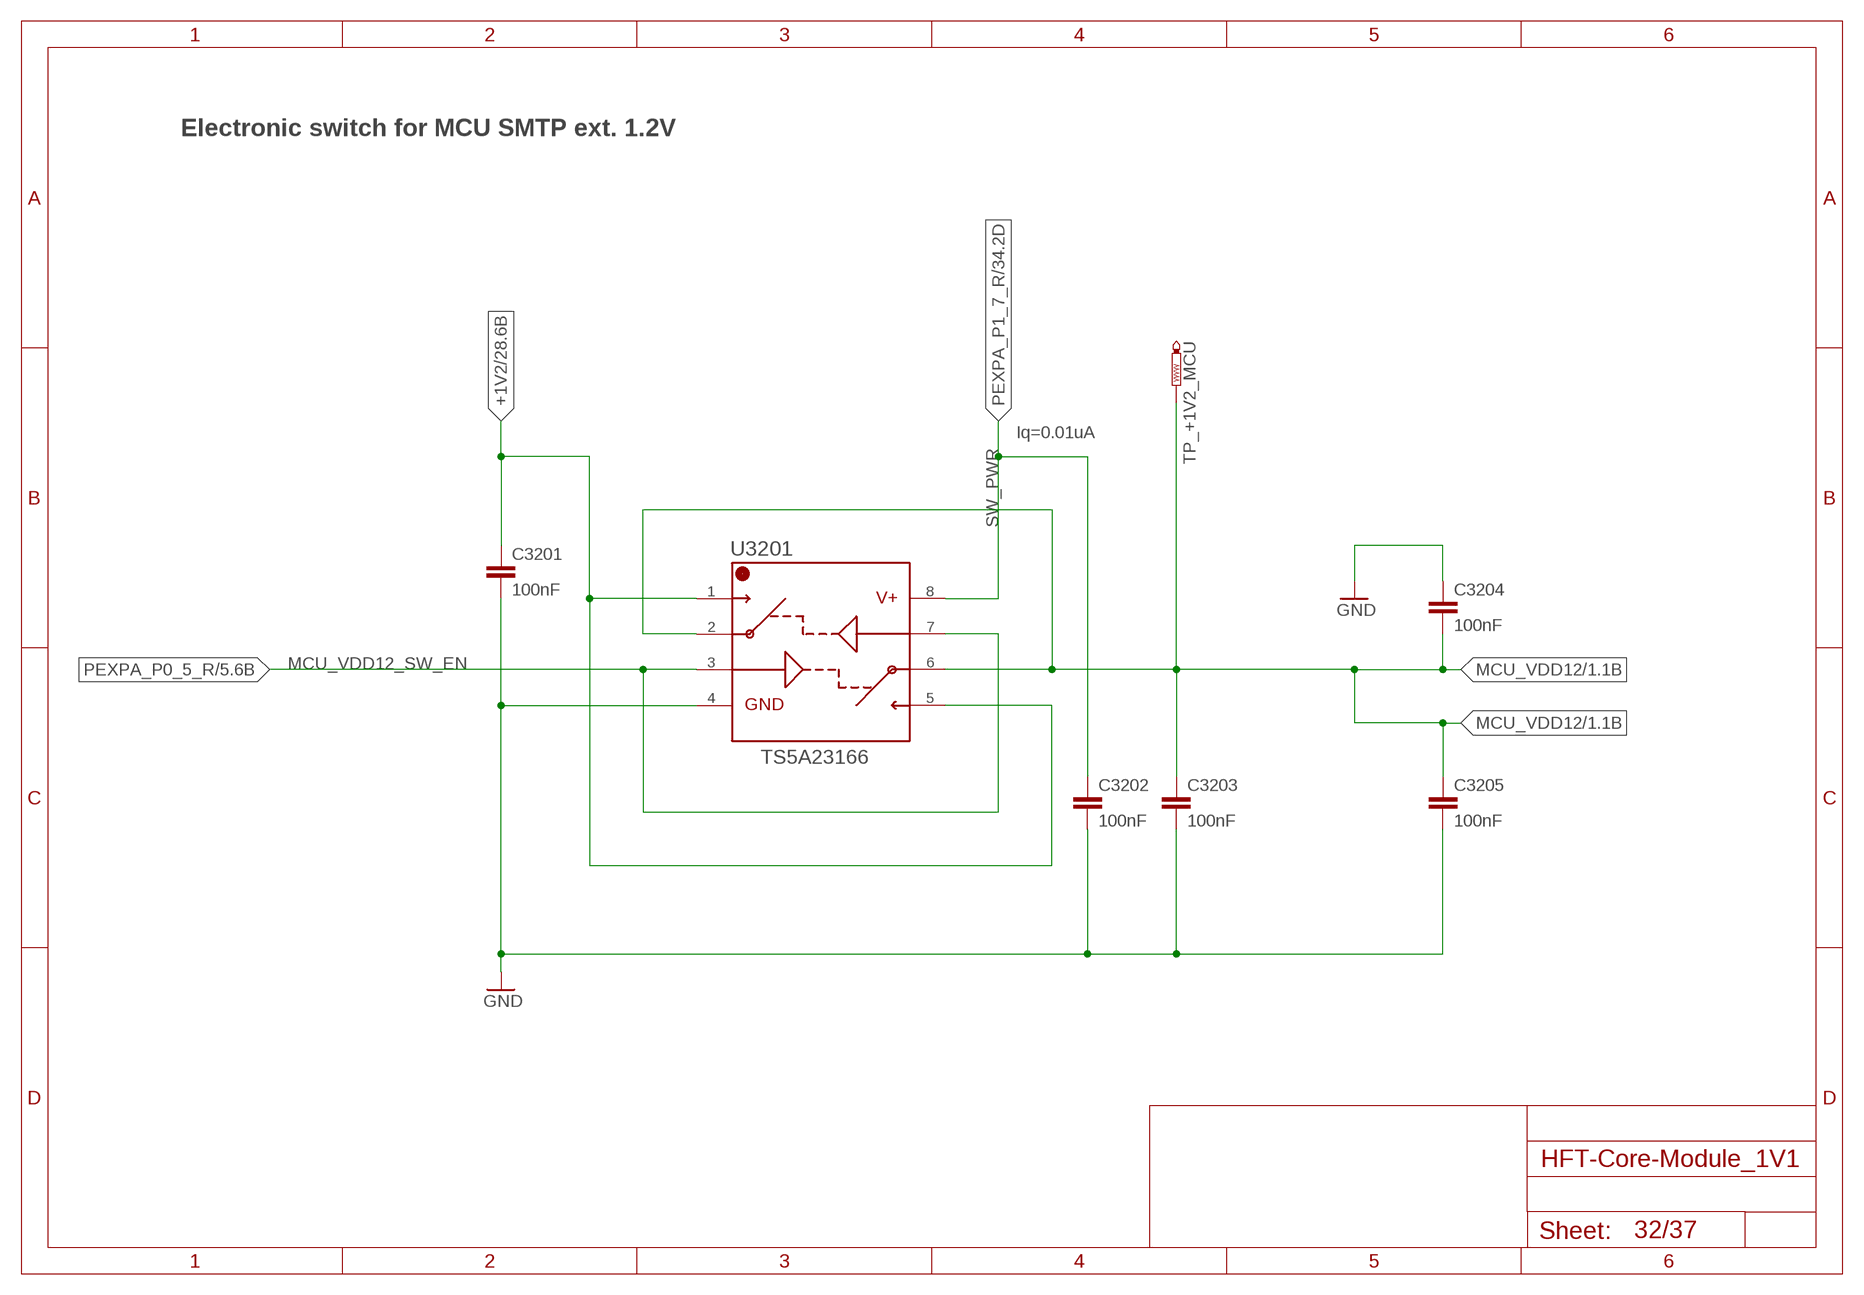
[diagram p31: schematic, sheet 32]

### Parts
C3201  100nF  C-EUC0402  [C0402]
C3202  100nF  C-EUC0402  [C0402]
C3203  100nF  C-EUC0402  [C0402]
C3204  100nF  C-EUC0402  [C0402]
C3205  100nF  C-EUC0402  [C0402]
TP_+1V2_MCU  PTR1B1,27  [B1,27]
U3201  TS5A23166  [R-PDSO-G8]

### Nets
+1V2: C3201.1 U3201.1 U3201.5 ; also sheet 28
GND: C3201.2 C3202.2 C3203.2 C3204.1 C3205.2 U3201.4 ; also sheet 1,2,3,4,5,6,7,8,9,10,11,12,13,14,15,16,17,18,19,21,22,23,24,25,26,27,28,29,30,31,33,34,35,36,37
MCU_VDD12: C3203.1 C3204.2 C3205.1 TP_+1V2_MCU.TP U3201.2 U3201.6 ; also sheet 1
PEXPA_P0_5_R: U3201.3 U3201.7 ; also sheet 5
PEXPA_P1_7_R: C3202.1 U3201.8 ; also sheet 5,16,30,31,34

### Notes on the sheet
- Electronic switch for MCU SMTP ext. 1.2V
- Iq=0.01uA
- SW_PWR
- MCU_VDD12_SW_EN

## Sheet 33 of 37: USB Jack
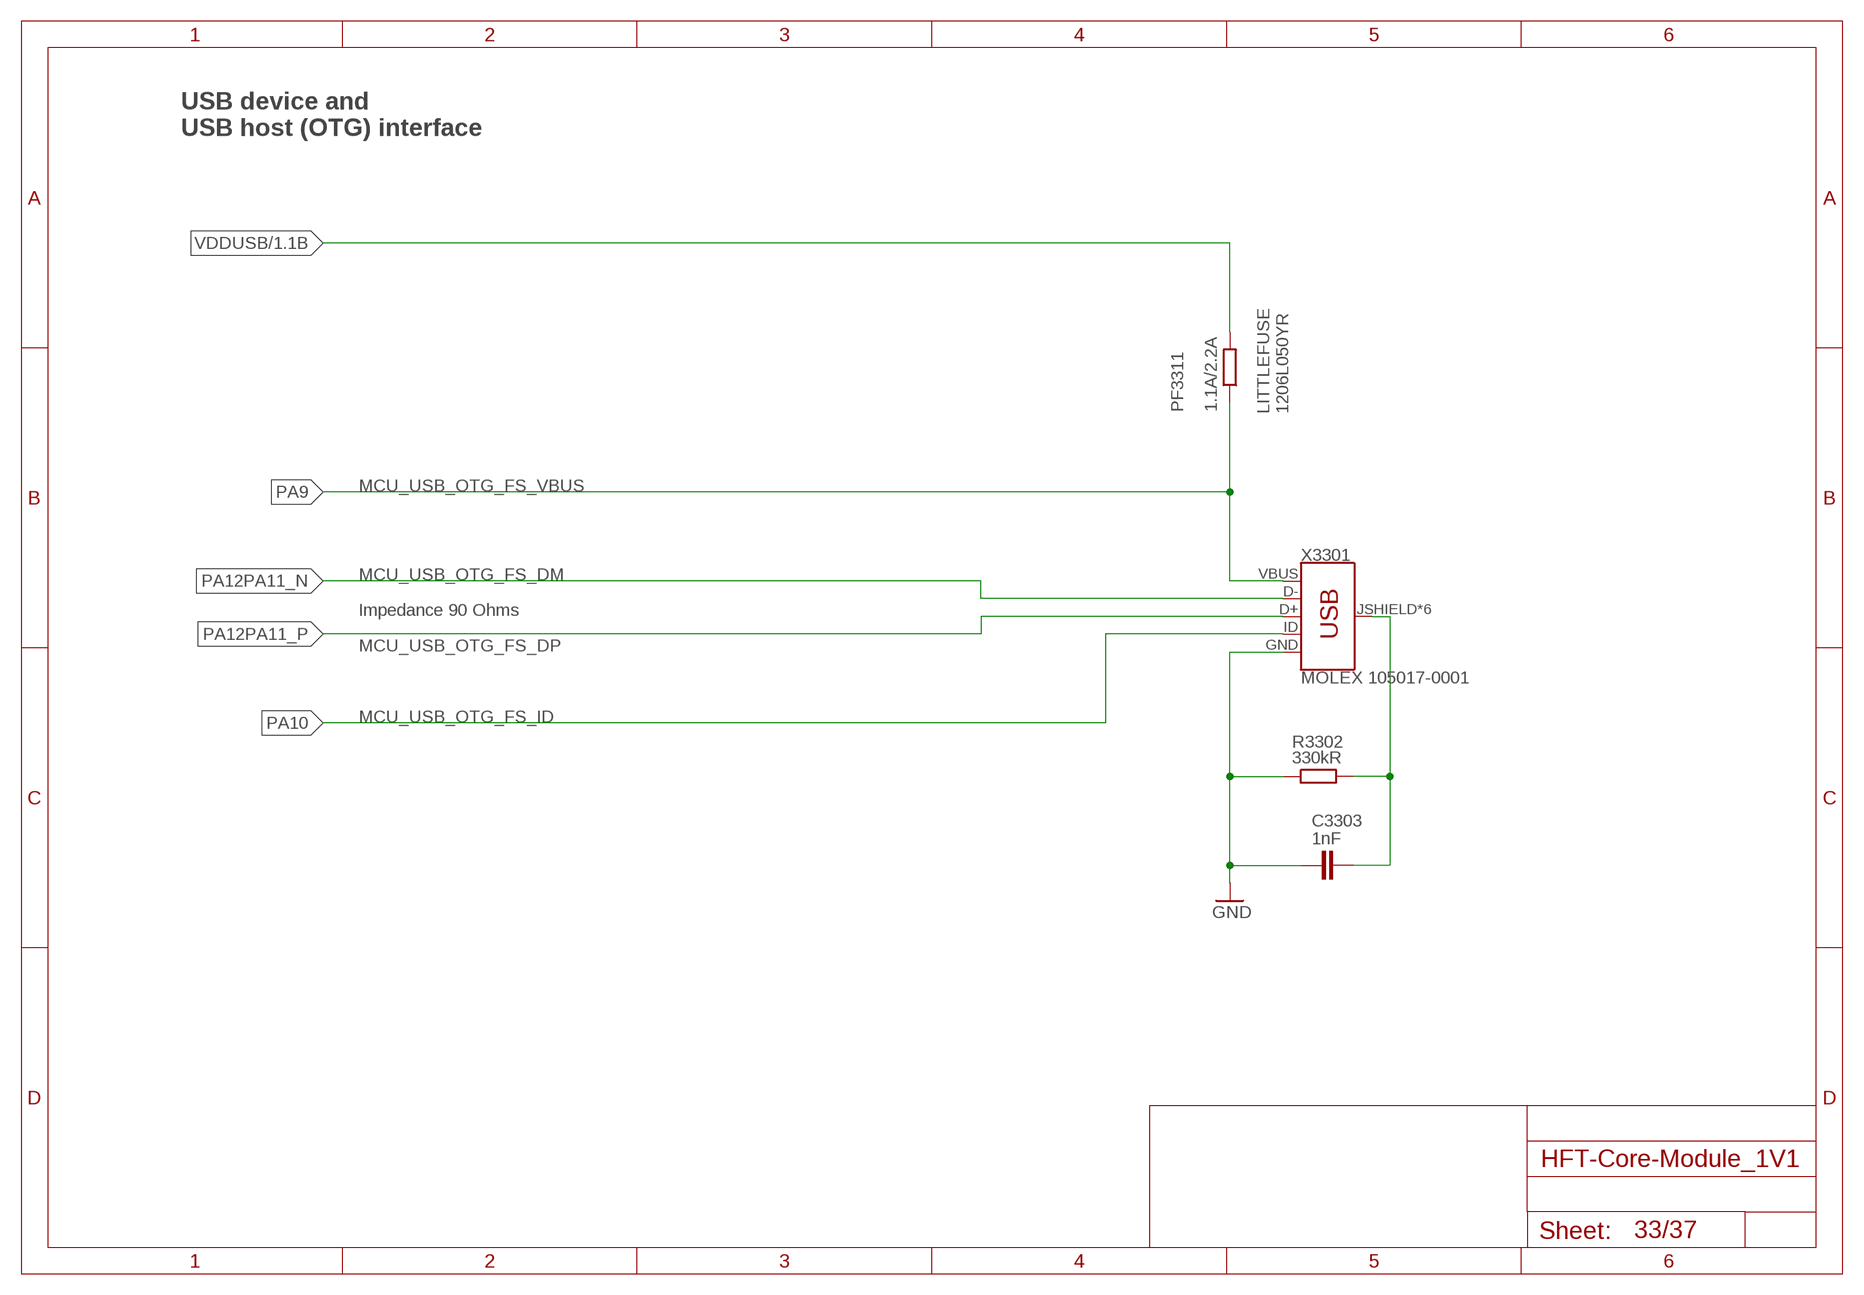
[diagram p32: schematic, sheet 33]

### Parts
C3303  1nF  C-EUC0402  [C0402]
PF3311  1.1A/2.2A  R-EU_M1206  [M1206]
R3302  330kR  R-EU_R0402  [R0402]
X3301  MOLEX 105017-0001  USB_MICRO-B_MOLEX  [USB-B-MICRO-SMD_MOLEX-105017-0001]

### Nets
GND: C3303.1 R3302.1 X3301.GND ; also sheet 1,2,3,4,5,6,7,8,9,10,11,12,13,14,15,16,17,18,19,21,22,23,24,25,26,27,28,29,30,31,32,34,35,36,37
PA9: PF3311.1 X3301.VBUS(J_VUSB) ; also sheet 1
PA10: X3301.ID(J_ID) ; also sheet 1
PA12PA11_N [usb_pair]: X3301.D-(J_D-) ; also sheet 1
PA12PA11_P [usb_pair]: X3301.D+(J_D+) ; also sheet 1
USB_SHIELD: C3303.2 R3302.2 X3301.JSHIELD(SHIELD) X3301.JSHIELD@2(SHIELD) X3301.JSHIELD@3(SHIELD) X3301.JSHIELD@4(SHIELD) X3301.JSHIELD@5(SHIELD) X3301.JSHIELD@6(SHIELD)
VDDUSB: PF3311.2 ; also sheet 1,29

### Notes on the sheet
- USB device and
  USB host (OTG) interface
- LITTLEFUSE
  1206L050YR
- MCU_USB_OTG_FS_VBUS
- MCU_USB_OTG_FS_DM
- Impedance 90 Ohms
- MCU_USB_OTG_FS_DP
- MCU_USB_OTG_FS_ID

## Sheet 34 of 37: SMA sockets
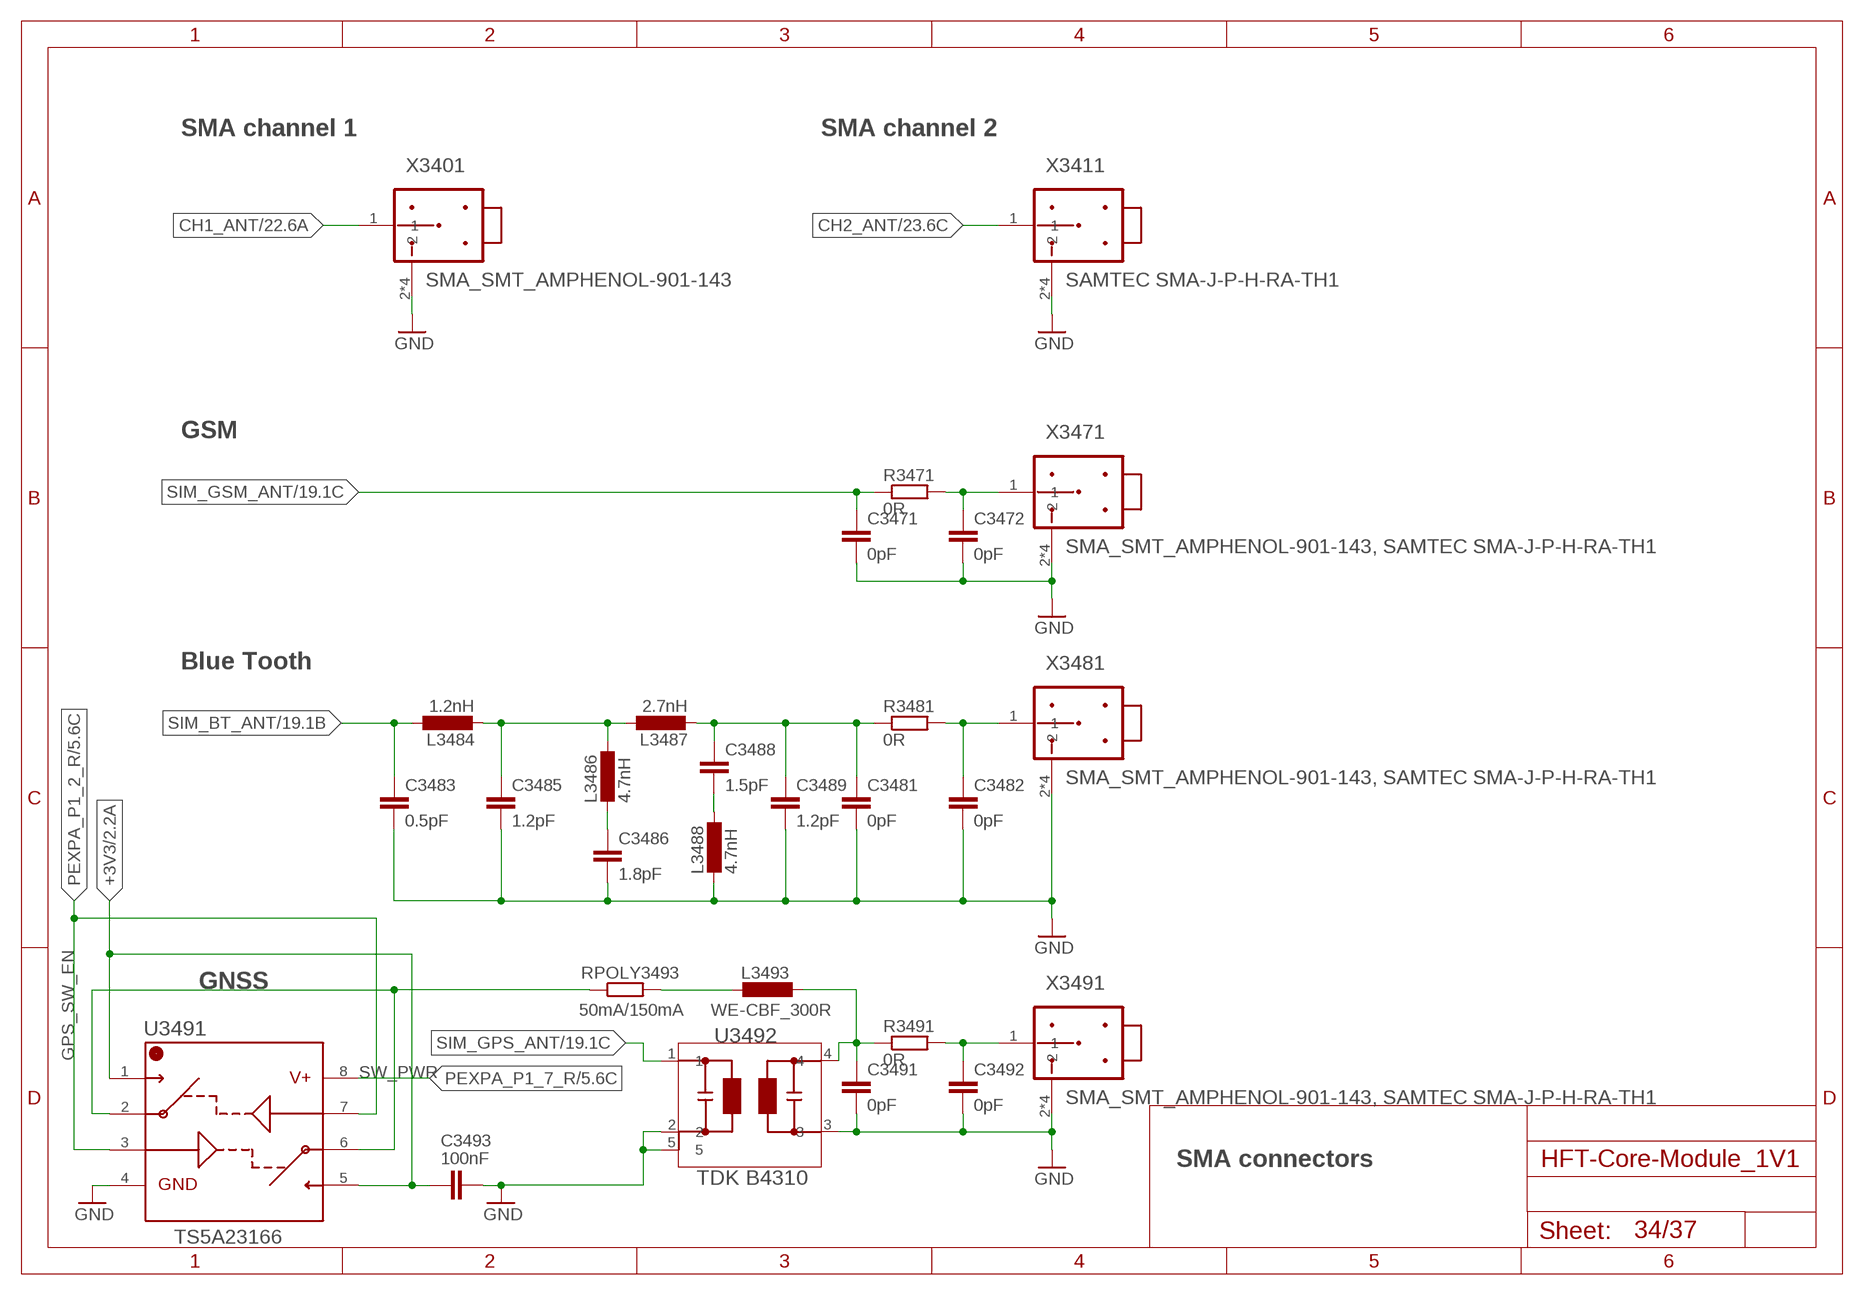
[diagram p33: schematic, sheet 34]

### Parts
C3471  0pF  C-EUC0402  [C0402]
C3472  0pF  C-EUC0402  [C0402]
C3481  0pF  C-EUC0402  [C0402]
C3482  0pF  C-EUC0402  [C0402]
C3483  0.5pF  C-EUC0402  [C0402]
C3485  1.2pF  C-EUC0402  [C0402]
C3486  1.8pF  C-EUC0402  [C0402]
C3488  1.5pF  C-EUC0402  [C0402]
C3489  1.2pF  C-EUC0402  [C0402]
C3491  0pF  C-EUC0402  [C0402]
C3492  0pF  C-EUC0402  [C0402]
C3493  100nF  C-EUC0402  [C0402]
L3484  1.2nH  L-EUL0603  [L0603]
L3486  4.7nH  L-EUL0603  [L0603]
L3487  2.7nH  L-EUL0603  [L0603]
L3488  4.7nH  L-EUL0603  [L0603]
L3493  WE-CBF_300R  L-EUL3216C  [L3216C]
R3471  0R  R-EU_R0603  [R0603]
R3481  0R  R-EU_R0603  [R0603]
R3491  0R  R-EU_R0603  [R0603]
RPOLY3493  50mA/150mA  R-EU_R1210  [R1210]
U3491  TS5A23166  [R-PDSO-G8]
U3492  TDK B4310  TDK_B4310  [QCS5P]
X3401  SMA_SMT_AMPHENOL-901-143  [SMA_SMT_AMPHENOL_901-143]
X3411  SAMTEC SMA-J-P-H-RA-TH1  SMA_SMT_AMPHENOL-901-143  [SMA_SMT_AMPHENOL_901-143]
X3471  SMA_SMT_AMPHENOL-901-143, SAMTEC SMA-J-P-H-RA-TH1  SMA_SMT_AMPHENOL-901-143  [SMA_SMT_AMPHENOL_901-143]
X3481  SMA_SMT_AMPHENOL-901-143, SAMTEC SMA-J-P-H-RA-TH1  SMA_SMT_AMPHENOL-901-143  [SMA_SMT_AMPHENOL_901-143]
X3491  SMA_SMT_AMPHENOL-901-143, SAMTEC SMA-J-P-H-RA-TH1  SMA_SMT_AMPHENOL-901-143  [SMA_SMT_AMPHENOL_901-143]

### Nets
+3V3: C3493.1 U3491.1 U3491.5 ; also sheet 2,4,5,6,7,8,9,10,11,13,14,15,22,23,25,26,27,28,30,31,36
+3V3_GPS: RPOLY3493.1 U3491.2 U3491.6
BT_ANT [single50R_1-2_15-16]: C3482.1 R3481.2 X3481.1
CH1_ANT: X3401.1 ; also sheet 22
CH2_ANT: X3411.1 ; also sheet 23
GND: C3471.2 C3472.2 C3481.2 C3482.2 C3483.2 C3485.2 C3486.2 C3489.2 C3491.2 C3492.2 C3493.2 L3488.2 U3491.4 U3492.2 U3492.3 U3492.5 X3401.2 X3401.3 X3401.4 X3401.5 X3411.2 X3411.3 X3411.4 X3411.5 X3471.2 X3471.3 X3471.4 X3471.5 X3481.2 X3481.3 X3481.4 X3481.5 X3491.2 X3491.3 X3491.4 X3491.5 ; also sheet 1,2,3,4,5,6,7,8,9,10,11,12,13,14,15,16,17,18,19,21,22,23,24,25,26,27,28,29,30,31,32,33,35,36,37
GPS_ANT [single50R_1-2_15-16]: C3492.1 R3491.2 X3491.1
GPS_ANT_SAW [single50R_1-2_15-16]: C3491.1 L3493.1 R3491.1 U3492.4
GPS_POLY [pwr_ttl]: L3493.2 RPOLY3493.2
GSM_ANT [single50R_1-2_15-16]: C3472.1 R3471.2 X3471.1
PEXPA_P1_2_R: U3491.3 U3491.7 ; also sheet 5
PEXPA_P1_7_R: U3491.8 ; also sheet 5,16,30,31,32
SIM_BT_ANT [single50R_1-2_15-16]: C3483.1 L3484.1 ; also sheet 19
SIM_BT_ANT_L [single50R_1-2_15-16]: C3485.1 L3484.2 L3486.1 L3487.1
SIM_BT_ANT_L_L [single50R_1-2_15-16]: C3481.1 C3488.1 C3489.1 L3487.2 R3481.1
SIM_BT_ANT_L_L_LC: C3488.2 L3488.1
SIM_BT_ANT_L_LC: C3486.1 L3486.2
SIM_GPS_ANT [single50R_1-2_15-16]: U3492.1 ; also sheet 19
SIM_GSM_ANT [single50R_1-2_15-16]: C3471.1 R3471.1 ; also sheet 19

### Notes on the sheet
- SMA channel 1 | SMA channel 2
- GSM
- Blue Tooth
- GNSS
- GPS_SW_EN
- SW_PWR
- SMA connectors

## Sheet 35 of 37: 3.5 mm Jack
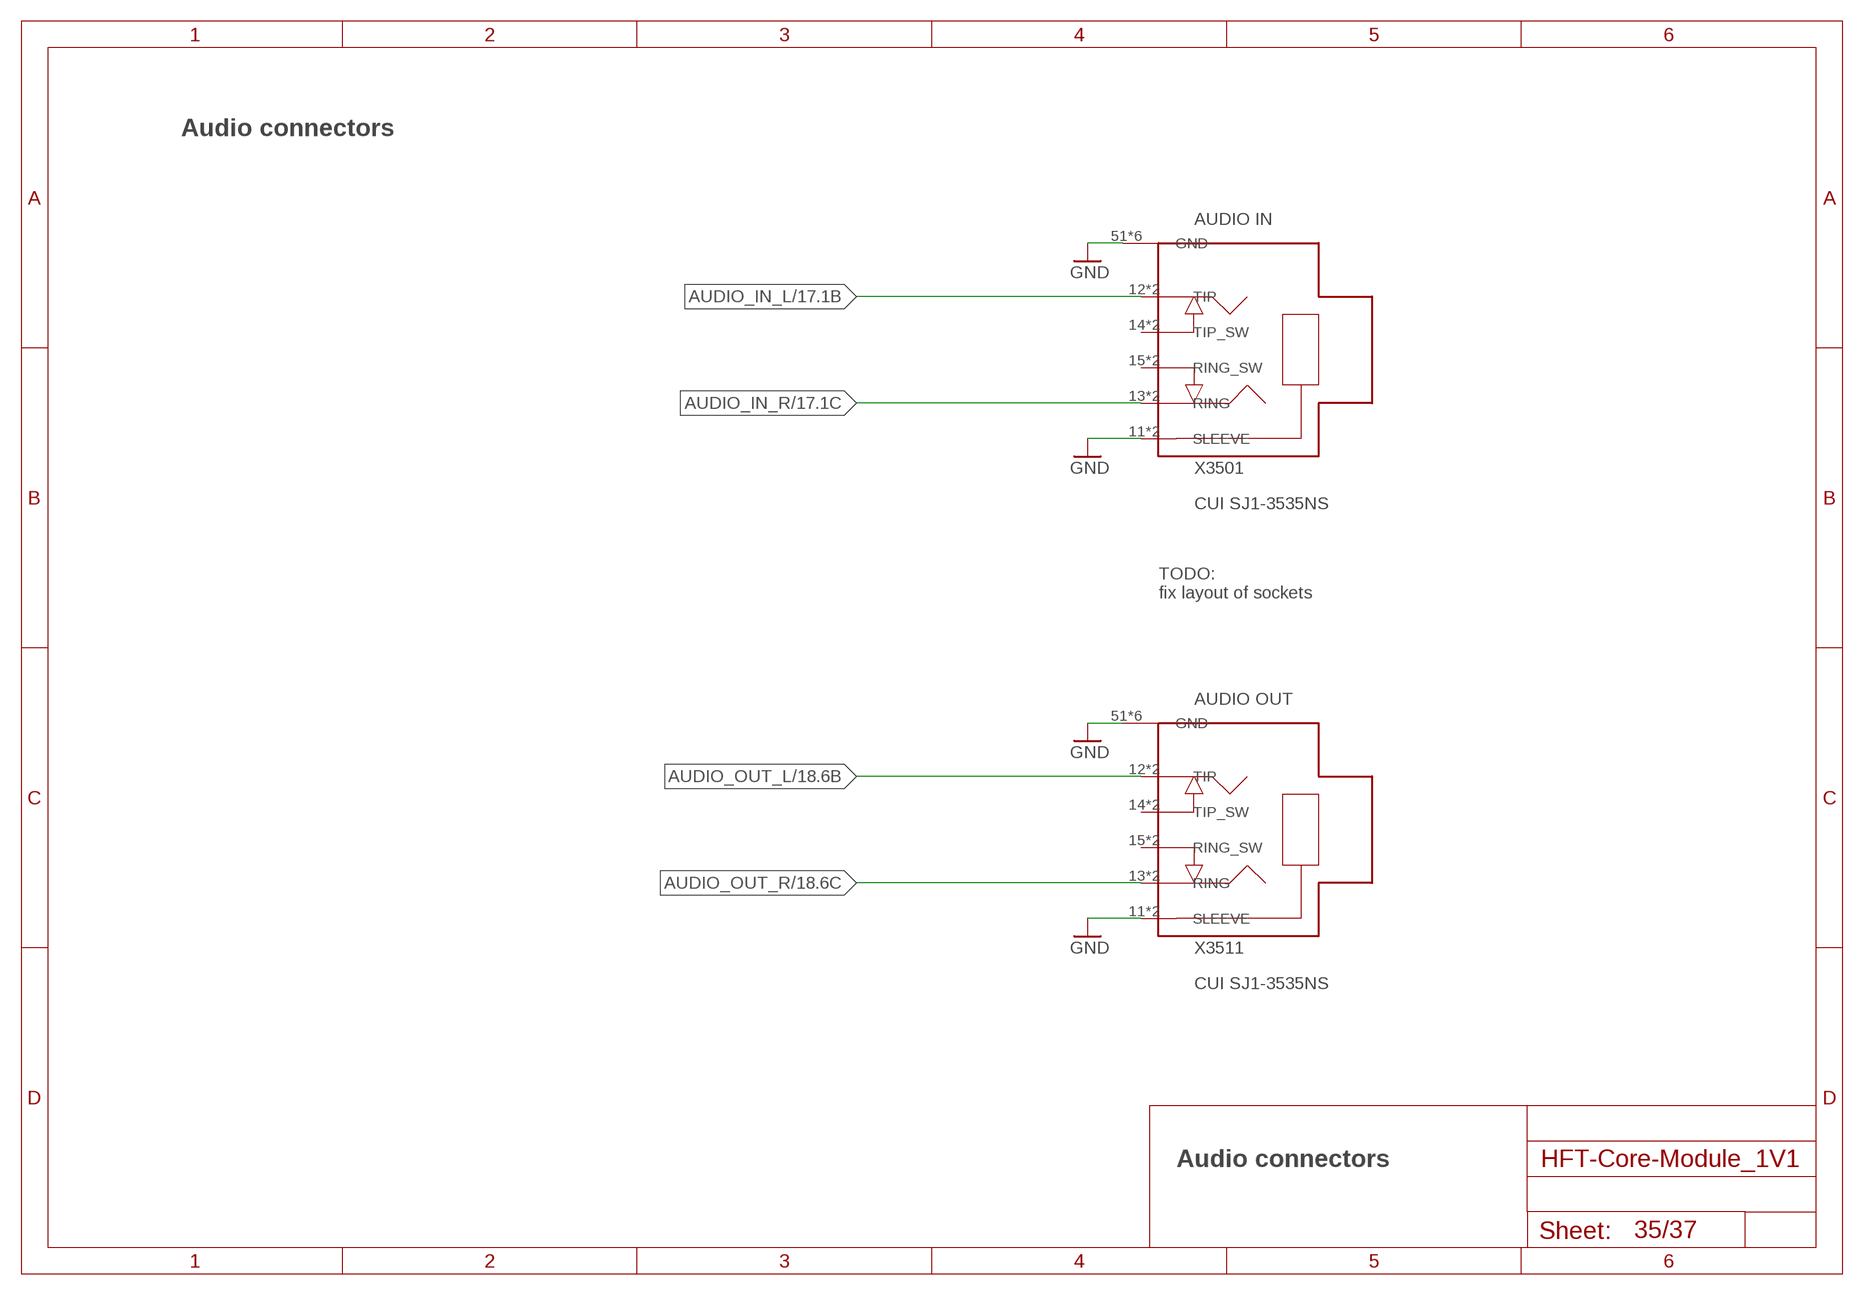
[diagram p34: schematic, sheet 35]

### Parts
X3501  CUI SJ1-3535NS  SJ1-353XNS_3MM5-STEREO-AUDIO-JACKS  [SJ1-353XNS_3MM5-STEREO-AUDIO-JACKS]
X3511  CUI SJ1-3535NS  SJ1-353XNS_3MM5-STEREO-AUDIO-JACKS  [SJ1-353XNS_3MM5-STEREO-AUDIO-JACKS]

### Nets
AUDIO_IN_L: X3501.12(TIP) X3501.22(TIP) ; also sheet 17
AUDIO_IN_R: X3501.13(RING) X3501.23(RING) ; also sheet 17
AUDIO_OUT_L: X3511.12(TIP) X3511.22(TIP) ; also sheet 18
AUDIO_OUT_R: X3511.13(RING) X3511.23(RING) ; also sheet 18
GND: X3501.11(SLEEVE) X3501.21(SLEEVE) X3501.51(GND) X3501.52(GND) X3501.53(GND) X3501.61(GND) X3501.62(GND) X3501.63(GND) X3511.11(SLEEVE) X3511.21(SLEEVE) X3511.51(GND) X3511.52(GND) X3511.53(GND) X3511.61(GND) X3511.62(GND) X3511.63(GND) ; also sheet 1,2,3,4,5,6,7,8,9,10,11,12,13,14,15,16,17,18,19,21,22,23,24,25,26,27,28,29,30,31,32,33,34,36,37
Unconnected: X3501.14(TIP_SW) X3501.15(RING_SW) X3501.24(TIP_SW) X3501.25(RING_SW) X3511.14(TIP_SW) X3511.15(RING_SW) X3511.24(TIP_SW) X3511.25(RING_SW)

### Notes on the sheet
- Audio connectors
- AUDIO IN
- TODO:
  fix layout of sockets
- AUDIO OUT
- Audio connectors

## Sheet 36 of 37: Expansion Connectors
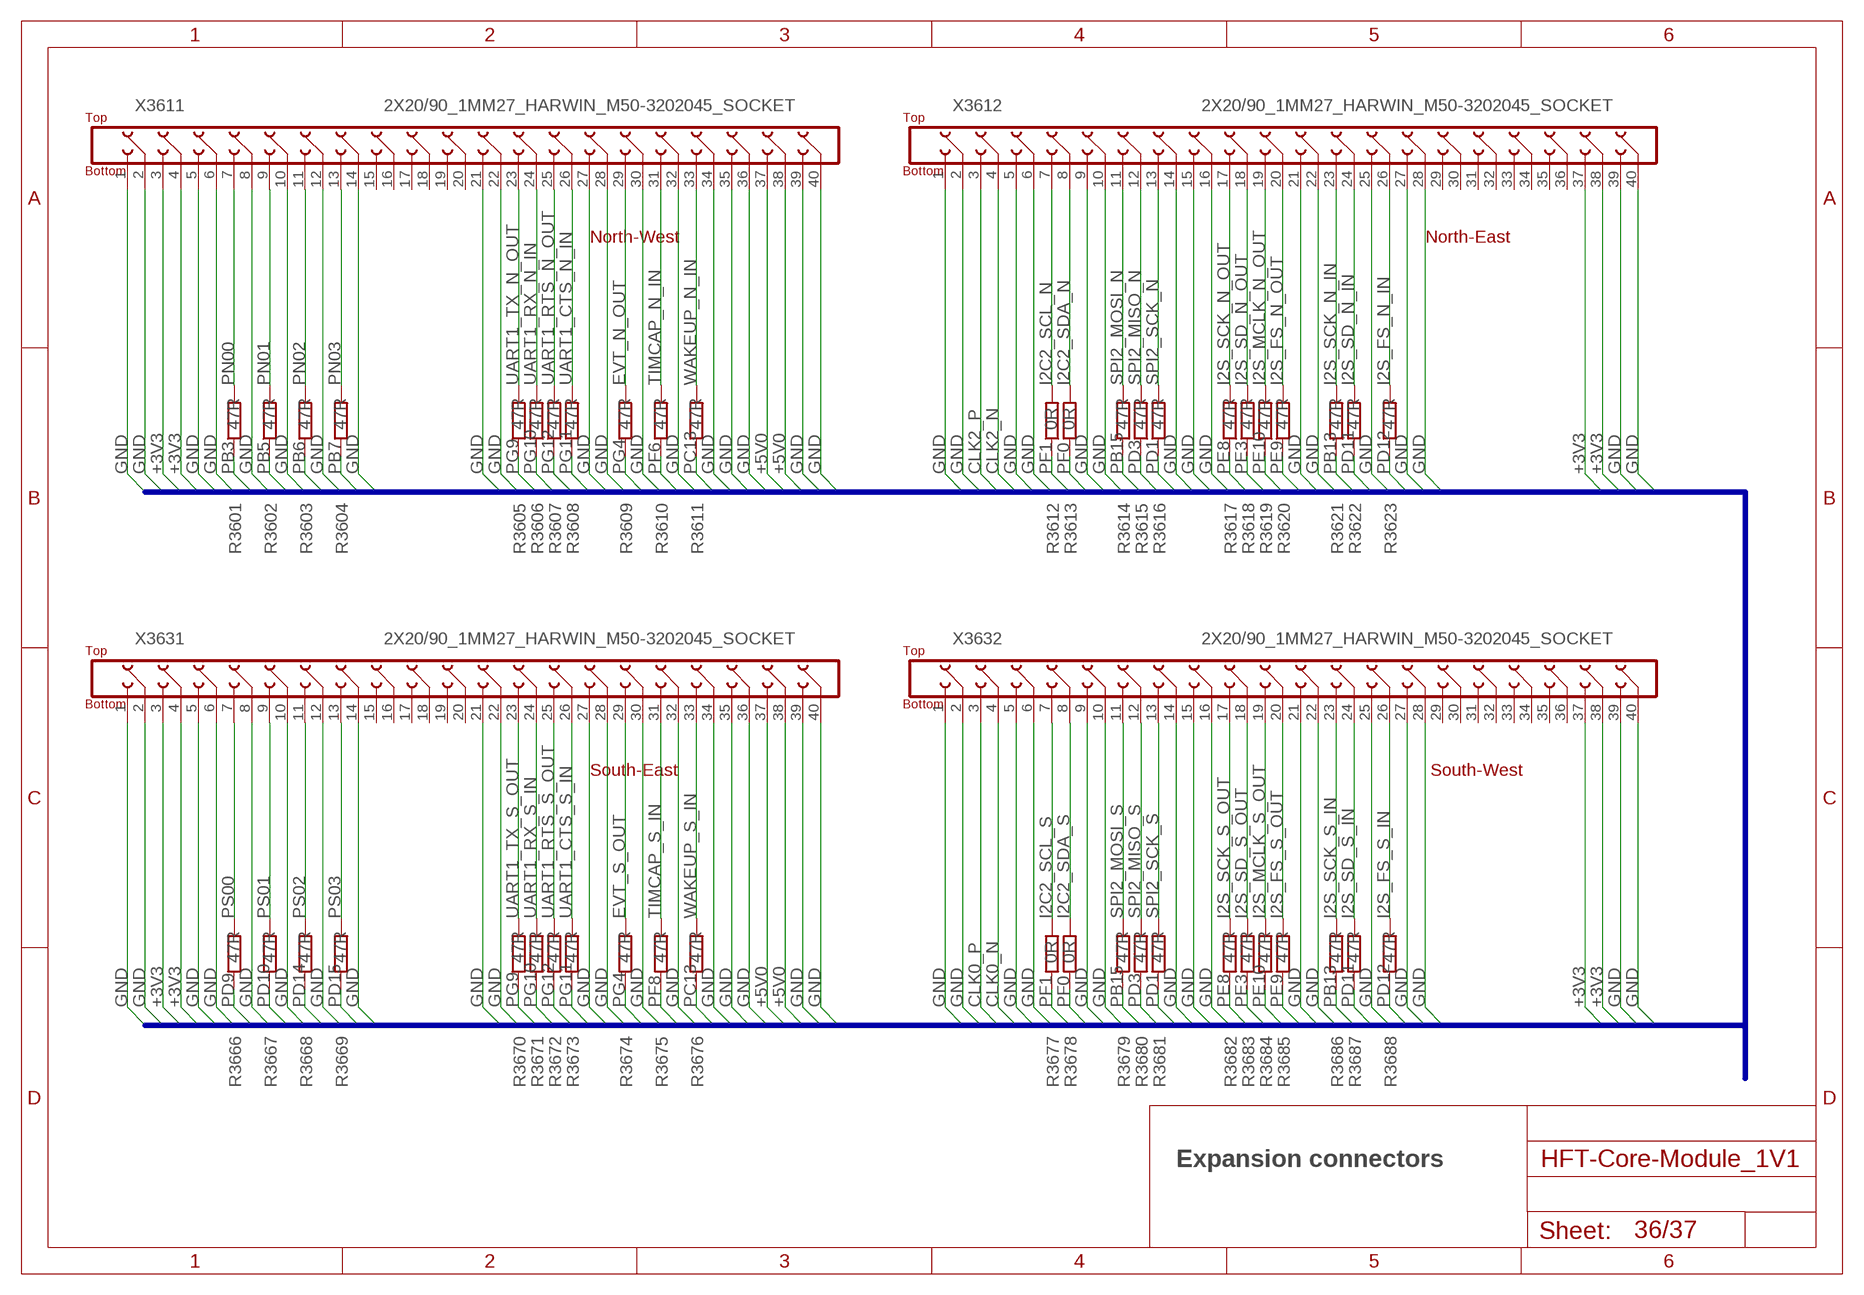
[diagram p35: schematic, sheet 36]

### Parts
R3601  47R  R-EU_R0402  [R0402]
R3602  47R  R-EU_R0402  [R0402]
R3603  47R  R-EU_R0402  [R0402]
R3604  47R  R-EU_R0402  [R0402]
R3605  47R  R-EU_R0402  [R0402]
R3606  47R  R-EU_R0402  [R0402]
R3607  47R  R-EU_R0402  [R0402]
R3608  47R  R-EU_R0402  [R0402]
R3609  47R  R-EU_R0402  [R0402]
R3610  47R  R-EU_R0402  [R0402]
R3611  47R  R-EU_R0402  [R0402]
R3612  0R  R-EU_R0402  [R0402]
R3613  0R  R-EU_R0402  [R0402]
R3614  47R  R-EU_R0402  [R0402]
R3615  47R  R-EU_R0402  [R0402]
R3616  47R  R-EU_R0402  [R0402]
R3617  47R  R-EU_R0402  [R0402]
R3618  47R  R-EU_R0402  [R0402]
R3619  47R  R-EU_R0402  [R0402]
R3620  47R  R-EU_R0402  [R0402]
R3621  47R  R-EU_R0402  [R0402]
R3622  47R  R-EU_R0402  [R0402]
R3623  47R  R-EU_R0402  [R0402]
R3666  47R  R-EU_R0402  [R0402]
R3667  47R  R-EU_R0402  [R0402]
R3668  47R  R-EU_R0402  [R0402]
R3669  47R  R-EU_R0402  [R0402]
R3670  47R  R-EU_R0402  [R0402]
R3671  47R  R-EU_R0402  [R0402]
R3672  47R  R-EU_R0402  [R0402]
R3673  47R  R-EU_R0402  [R0402]
R3674  47R  R-EU_R0402  [R0402]
R3675  47R  R-EU_R0402  [R0402]
R3676  47R  R-EU_R0402  [R0402]
R3677  0R  R-EU_R0402  [R0402]
R3678  0R  R-EU_R0402  [R0402]
R3679  47R  R-EU_R0402  [R0402]
R3680  47R  R-EU_R0402  [R0402]
R3681  47R  R-EU_R0402  [R0402]
R3682  47R  R-EU_R0402  [R0402]
R3683  47R  R-EU_R0402  [R0402]
R3684  47R  R-EU_R0402  [R0402]
R3685  47R  R-EU_R0402  [R0402]
R3686  47R  R-EU_R0402  [R0402]
R3687  47R  R-EU_R0402  [R0402]
R3688  47R  R-EU_R0402  [R0402]
X3611  2X20/90_1MM27_HARWIN_M50-3202045_SOCKET  [2X20/90_1MM27_HARWIN_M50-3202045_SOCKET]
X3612  2X20/90_1MM27_HARWIN_M50-3202045_SOCKET  [2X20/90_1MM27_HARWIN_M50-3202045_SOCKET]
X3631  2X20/90_1MM27_HARWIN_M50-3202045_SOCKET  [2X20/90_1MM27_HARWIN_M50-3202045_SOCKET]
X3632  2X20/90_1MM27_HARWIN_M50-3202045_SOCKET  [2X20/90_1MM27_HARWIN_M50-3202045_SOCKET]

### Nets
+3V3: X3611.3 X3611.4 X3612.37 X3612.38 X3631.3 X3631.4 X3632.37 X3632.38 ; also sheet 2,4,5,6,7,8,9,10,11,13,14,15,22,23,25,26,27,28,30,31,34
+5V0 [pwrA5]: X3611.37 X3611.38 X3631.37 X3631.38 ; also sheet 25,26,27
CLK0_N: X3632.4 ; also sheet 16
CLK0_P: X3632.3 ; also sheet 16
CLK2_N: X3612.4 ; also sheet 16
CLK2_P: X3612.3 ; also sheet 16
EVT_N_OUT: R3609.2 X3611.29
EVT_S_OUT: R3674.2 X3631.29
GND: X3611.1 X3611.2 X3611.5 X3611.6 X3611.8 X3611.10 X3611.12 X3611.14 X3611.21 X3611.22 X3611.27 X3611.28 X3611.30 X3611.32 X3611.34 X3611.35 X3611.36 X3611.39 X3611.40 X3612.1 X3612.2 X3612.5 X3612.6 X3612.9 X3612.10 X3612.14 X3612.15 X3612.16 X3612.21 X3612.22 X3612.25 X3612.27 X3612.28 X3612.39 X3612.40 X3631.1 X3631.2 X3631.5 X3631.6 X3631.8 X3631.10 X3631.12 X3631.14 X3631.21 X3631.22 X3631.27 X3631.28 X3631.30 X3631.32 X3631.34 X3631.35 X3631.36 X3631.39 X3631.40 X3632.1 X3632.2 X3632.5 X3632.6 X3632.9 X3632.10 X3632.14 X3632.15 X3632.16 X3632.21 X3632.22 X3632.25 X3632.27 X3632.28 X3632.39 X3632.40 ; also sheet 1,2,3,4,5,6,7,8,9,10,11,12,13,14,15,16,17,18,19,21,22,23,24,25,26,27,28,29,30,31,32,33,34,35,37
I2C2_SCL_N: R3612.2 X3612.7
I2C2_SCL_S: R3677.2 X3632.7
I2C2_SDA_N: R3613.2 X3612.8
I2C2_SDA_S: R3678.2 X3632.8
I2S_FS_N_IN: R3623.2 X3612.26
I2S_FS_N_OUT: R3620.2 X3612.20
I2S_FS_S_IN: R3688.2 X3632.26
I2S_FS_S_OUT: R3685.2 X3632.20
I2S_MCLK_N_OUT: R3619.2 X3612.19
I2S_MCLK_S_OUT: R3684.2 X3632.19
I2S_SCK_N_IN: R3621.2 X3612.23
I2S_SCK_N_OUT: R3617.2 X3612.17
I2S_SCK_S_IN: R3686.2 X3632.23
I2S_SCK_S_OUT: R3682.2 X3632.17
I2S_SD_N_IN: R3622.2 X3612.24
I2S_SD_N_OUT: R3618.2 X3612.18
I2S_SD_S_IN: R3687.2 X3632.24
I2S_SD_S_OUT: R3683.2 X3632.18
PB3: R3601.1 ; also sheet 1
PB5: R3602.1 ; also sheet 1
PB6: R3603.1 ; also sheet 1
PB7: R3604.1 ; also sheet 1
PB13: R3621.1 R3686.1 ; also sheet 1,17
PB15: R3614.1 R3679.1 ; also sheet 1
PC13: R3611.1 R3676.1 ; also sheet 1
PD1: R3616.1 R3681.1 ; also sheet 1
PD3: R3615.1 R3680.1 ; also sheet 1
PD9: R3666.1 ; also sheet 1
PD10: R3667.1 ; also sheet 1
PD11: R3622.1 R3687.1 ; also sheet 1,17
PD12: R3623.1 R3688.1 ; also sheet 1,17
PD14: R3668.1 ; also sheet 1
PD15: R3669.1 ; also sheet 1
PE3: R3618.1 R3683.1 ; also sheet 1,18
PE8: R3617.1 R3682.1 ; also sheet 1,18
PE9: R3620.1 R3685.1 ; also sheet 1,18
PE10: R3619.1 R3684.1 ; also sheet 1,18
PF0: R3613.1 R3678.1 ; also sheet 1
PF1: R3612.1 R3677.1 ; also sheet 1
PF6: R3610.1 ; also sheet 1
PF8: R3675.1 ; also sheet 1
PG4: R3609.1 R3674.1 ; also sheet 1
PG9: R3605.1 R3670.1 ; also sheet 1
PG10: R3606.1 R3671.1 ; also sheet 1
PG11: R3608.1 R3673.1 ; also sheet 1
PG12: R3607.1 R3672.1 ; also sheet 1
PN00: R3601.2 X3611.7
PN01: R3602.2 X3611.9
PN02: R3603.2 X3611.11
PN03: R3604.2 X3611.13
PS00: R3666.2 X3631.7
PS01: R3667.2 X3631.9
PS02: R3668.2 X3631.11
PS03: R3669.2 X3631.13
SPI2_MISO_N: R3615.2 X3612.12
SPI2_MISO_S: R3680.2 X3632.12
SPI2_MOSI_N: R3614.2 X3612.11
SPI2_MOSI_S: R3679.2 X3632.11
SPI2_SCK_N: R3616.2 X3612.13
SPI2_SCK_S: R3681.2 X3632.13
TIMCAP_N_IN: R3610.2 X3611.31
TIMCAP_S_IN: R3675.2 X3631.31
UART1_CTS_N_IN: R3608.2 X3611.26
UART1_CTS_S_IN: R3673.2 X3631.26
UART1_RTS_N_OUT: R3607.2 X3611.25
UART1_RTS_S_OUT: R3672.2 X3631.25
UART1_RX_N_IN: R3606.2 X3611.24
UART1_RX_S_IN: R3671.2 X3631.24
UART1_TX_N_OUT: R3605.2 X3611.23
UART1_TX_S_OUT: R3670.2 X3631.23
WAKEUP_N_IN: R3611.2 X3611.33
WAKEUP_S_IN: R3676.2 X3631.33
Unconnected: X3611.15 X3611.16 X3611.17 X3611.18 X3611.19 X3611.20 X3612.29 X3612.30 X3612.31 X3612.32 X3612.33 X3612.34 X3612.35 X3612.36 X3631.15 X3631.16 X3631.17 X3631.18 X3631.19 X3631.20 X3632.29 X3632.30 X3632.31 X3632.32 X3632.33 X3632.34 X3632.35 X3632.36

### Buses
GND,+3V3,+5V0,CLK0_P,CLK0_N,CLK1_P,CLK1_N,CLK2_P,CLK2_N,MCU_WAKEUP,MCU_I2C1_SCL,MCU_I2C1_SDA,MCU_I2C2_SCL,MCU_I2C2_SDA,MCU_I2C3_SCL,MCU_I2C3_SDA,MCU_SPI1_SCK,MCU_SPI1_MOSI,MCU_SPI1_MISO,I2S_SCK_OUT,I2S_SD_OUT,I2S_MCLK_OUT,I2S_FS_OUT,PA[0..15],PB[0..15],PC[0..15],PD[0..15],PE[0..15],PF[0..15],PG[0..15],PH[0..3]

### Notes on the sheet
- North-West | North-East
- South-East | South-West
- Expansion connectors

## Sheet 37 of 37: Mounting holes
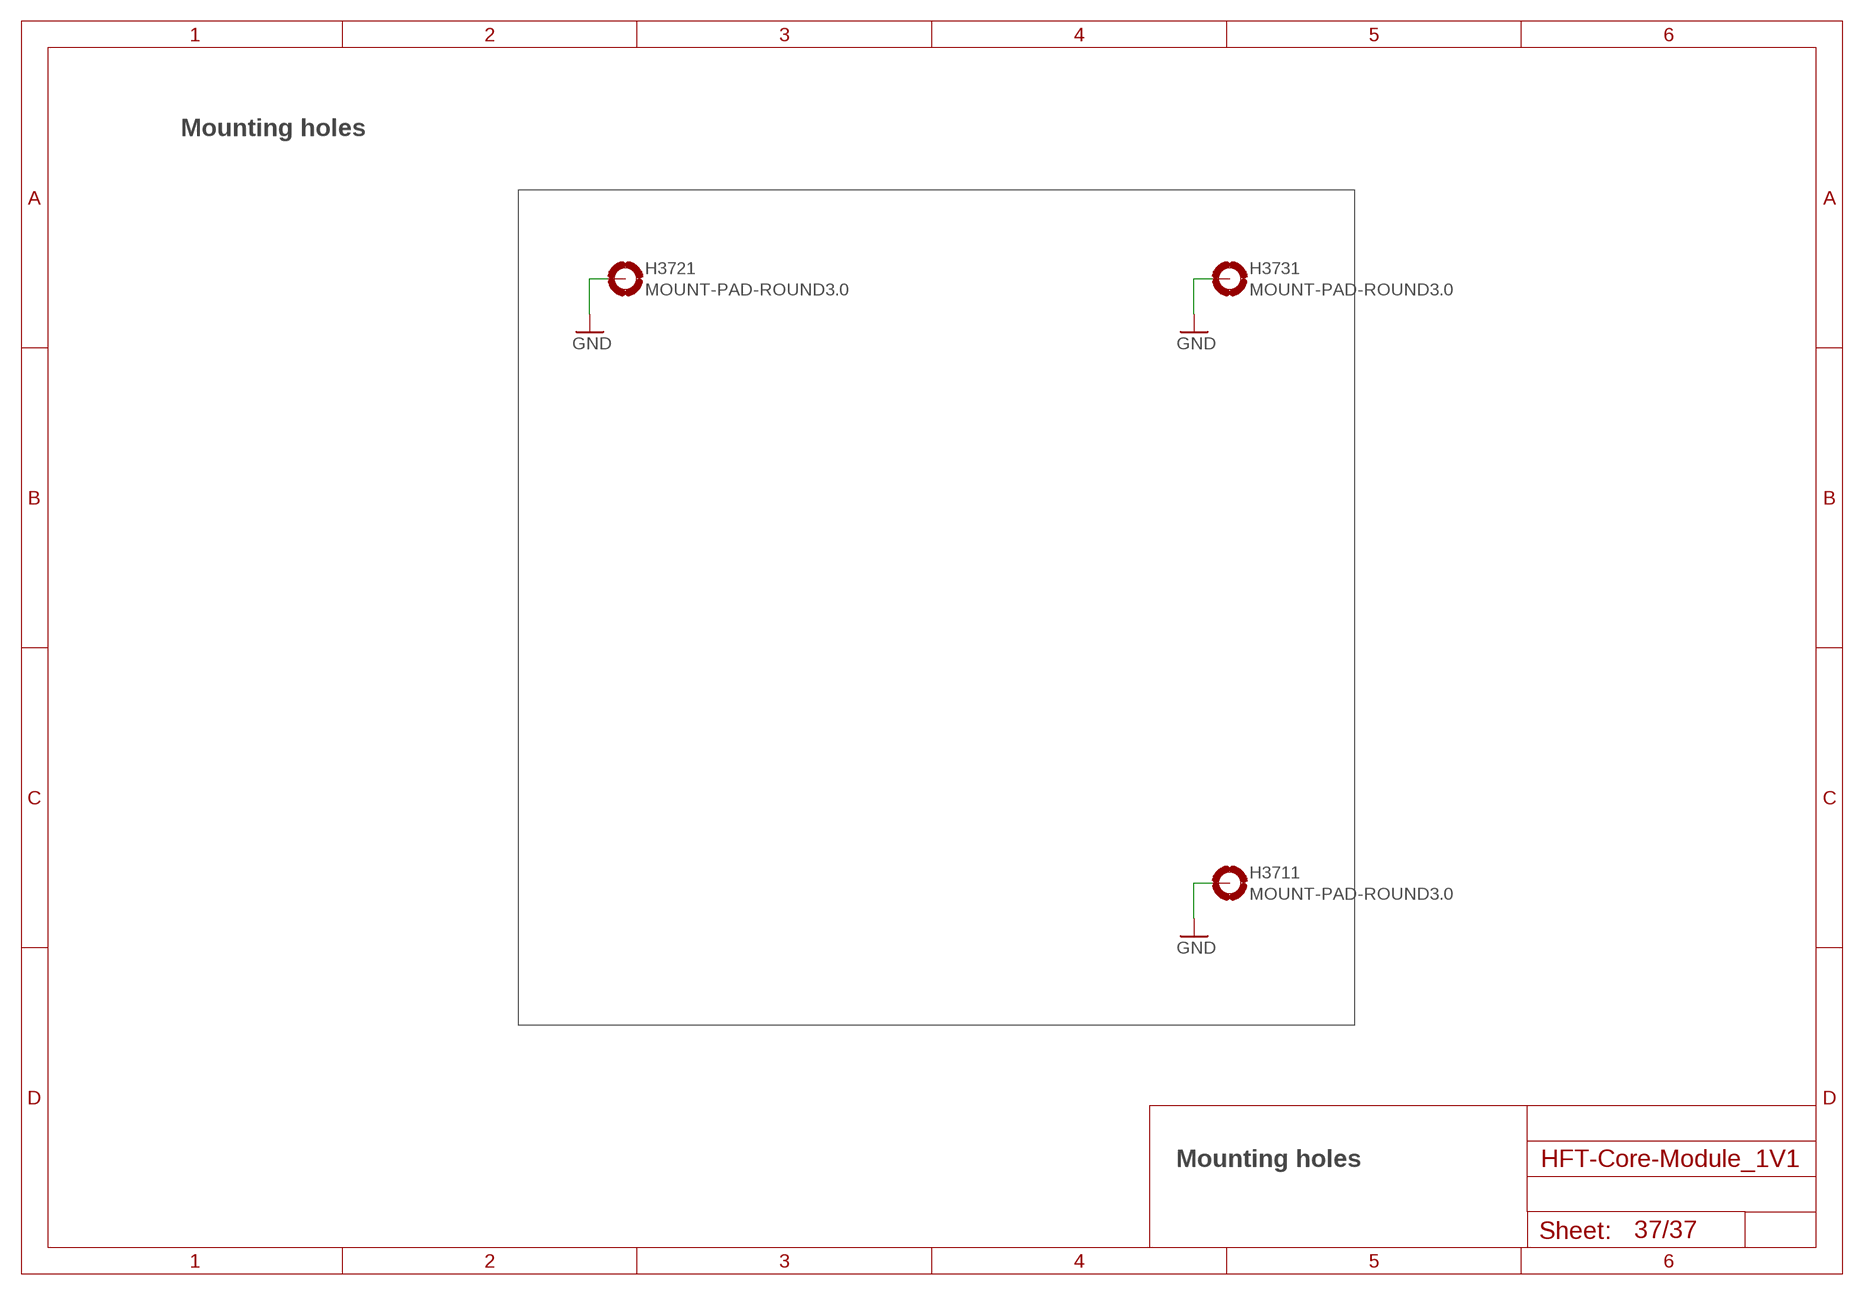
[diagram p36: schematic, sheet 37]

### Parts
H3711  MOUNT-PAD-ROUND3.0  [3,0-PAD]
H3721  MOUNT-PAD-ROUND3.0  [3,0-PAD]
H3731  MOUNT-PAD-ROUND3.0  [3,0-PAD]

### Nets
GND: H3711.B3,0(MOUNT) H3721.B3,0(MOUNT) H3731.B3,0(MOUNT) ; also sheet 1,2,3,4,5,6,7,8,9,10,11,12,13,14,15,16,17,18,19,21,22,23,24,25,26,27,28,29,30,31,32,33,34,35,36

### Notes on the sheet
- Mounting holes
- Mounting holes

## Power pins joined to a net without a drawn wire
S6: X1951.S6(A:S6)

## Library data of the parts
C0213 C0311 C0332 C0401-C0410 C0412 C0413 C0421-C0423 C0441 C0442 C0521 C0621 C0711 C0721 C0801 C0901 C1001 C1011 C1012 C1101 C1201-C1203 C1301-C1303 C1321 C1322 C1401 C1501 C1511 C1512 C1522 C1531 C1532 C1541-C1543 C1601-C1605 C1615 C1616 C1701-C1706 C1711 C1712 C1721 C1722 C1801-C1803 C1811 C1812 C1831 C1841 C1901-C1904 C1951-C1955 C1961 C2201-C2205 C2263-C2267 C2271 C2272 C2281-C2283 C2291-C2293 C2301-C2303 C2312-C2318 C2321-C2323 C2401-C2405 C2411 C2412 C2421-C2423 C2501-C2505 C2511 C2521 C2541 C2601-C2603 C2605 C2606 C2652 C2653 C2701 C2703 C2711 C2801 C2901-C2903 C3001-C3003 C3101-C3103 C3201-C3205 C3303 C3471 C3472 C3481-C3483 C3485 C3486 C3488 C3489 C3491-C3493 = df4iah_rcl:C-EU: CAPACITOR, European symbol
C0331 = df4iah_c-trimm:C-TRIMM: Trimm capacitor
C0451 C2682 = df4iah_rcl:CPOL-EU: POLARIZED CAPACITOR, European symbol
D1101 = df4iah_led:ASMT-YTB7-0AA02_RGB: Broadcom ASMT-YTB7-0AA02 Tricolor PLCC6 Black Surface LED
D1901 = df4iah_diode:D_SOD923: DIODE with SOD923 footprint
D1902 = df4iah_diode:ZENER-DIODE: Z-Diode
D2521 D2681 D2901 D2902 = df4iah_diode:CRS08: SCHOTTKY BARRIER RECTIFIER
H3711 H3721 H3731 = df4iah_holes:MOUNT-PAD-ROUND: MOUNTING PAD, round
L0411 L1701 L1801 L2201 L2261-L2264 L2282 L2291 L2311-L2317 L2321 L2411 L2501 L2601 L2651 L2711 L2891 L3484 L3486-L3488 = df4iah_rcl:L-EU: INDUCTOR, European symbol
L3493 = rcl:L-EU: INDUCTOR, European symbol
PF3311 R1113 R1123 R1133 RPOLY3493 = rcl:R-EU_: RESISTOR, European symbol
Q0321 Q1321 = df4iah_crystal:ABS07-32.768KHZ: ABRACON ABS07 32.768 kHz SMD LOW PROFILE CRYSTAL Source: http://www.abracon.com/Resonators/ABS07.pdf; FARNELL: 2467865; MANUFACTURER: ABS07-32.768KHZ-1-T
Q2211 Q2311 = df4iah_crystal:ABM3B: ABM3B Ceramic SMD Crystal Package: 5mm x 3.2mm x 1.1mm Variants: 16.0000 MHz 32.0000 MHz
R0121 R0201 R0202 R0222 R0401 R0421 R0441 R0521 R0531 R0581-R0596 R0611 R0612 R0621 R0631 R0681-R0689 R0693-R0696 R0891 R0892 R0901-R0906 R1031 R1051-R1053 R1111 R1112 R1121 R1122 R1131 R1132 R1301-R1304 R1331 R1332 R1521 R1531 R1538 R1539 R1541-R1543 R1623 R1631 R1632 R1643 R1644 R1651 R1661 R1711 R1712 R1721 R1722 R1751-R1753 R1761 R1811 R1812 R1821-R1824 R1831 R1841 R1901 R1941-R1944 R1951-R1953 R1961 R1962 R2011-R2018 R2111-R2114 R2121-R2124 R2211 R2221 R2224 R2251-R2253 R2321 R2331 R2332 R2341 R2351 R2391 R2411 R2501 R2511 R2512 R2521 R2541 R2554 R2611 R2612 R2621 R2622 R2631-R2633 R2641 R2642 R2651 R2681 R2701 R2713 R2731 R2801 R2901-R2904 R2911 R3302 R3471 R3481 R3491 R3601-R3623 R3666-R3688 = df4iah_rcl:R-EU_: RESISTOR, European symbol
S0212 = df4iah_switch:KSR223G_SMD_1POL: KSR223G KSR Series Subminiature Tact Switch for SMT
T1051 T1111 T1121 T1131 = transistor:BC846: NPN TRANSISTOR
TP_+1V2 TP_+1V2_MCU TP_+3V3_HICUR TP_+3V3_XO TP_+3V3_XO_PA TP_AX_ADC1 TP_AX_ADC2 TP_AX_IRQ TP_AX_TCXO_EN TP_BQ_VBAT TP_BQ_VOUT TP_BQ_VSTOR TP_IN_CLK1 TP_IN_CLK2 TP_LIPO_BAT TP_LIPO_CUR TP_LIPO_SYS TP_SX_DIO1-TP_SX_DIO3 TP_VBAT TP_VSOL TP_VUSB_SW = testpad:PTR1: TEST PIN
U0111 = df4iah_stm32l4:STM32L4Z_144PIN_SMPS: STM32L4XX LQFP packages with actual and functional symbols.
U0521 U0621 = df4iah_dataconvertion:PCAL6416A: NXP PCAL6416A Low-voltage translating 16-bit I²C-bus/SMBus I/O expander with interrupt output, reset, and configuration registers
U0711 U0721 = df4iah_memory:IS25LP032D: ISSI IS25LP032D 32Mb SERIAL FLASH MEMORY WITH 133MHZ MULTI I/O SPI & QUAD I/O QPI DTR INTERFACE
U0801 = df4iah_memory:CAT24C64: CAT24C64 Serial EEPROM 8k x 8Bits, I2C
U0911 = df4iah_lcd:ZIO_EINK_1IN54: ZIO E-Ink Display 1.54in. V1.0 200 x 200 px Size: 1.54 in. SPI bus
U1001 = df4iah_lcd:MIDAS_MCCOG21605B6W-FPTLWI: MIDAS MCCOG21605B6W-FPTLWI 16 x 2 character dot matrix LCD controlled by I2C bus 3.3V
U1301 = df4iah_sensors:BNO085: hillcrestlabs BNO085 triaxial Accelerometer triaxial Gyroscope triaxial Magnetometer 32-bit ARM® Cortex™-M0+ Low latency, 1kHz gyro rotation vector 28 pin LGA 3.8mm x 5.2mm x 1.1mm package
U1401 = df4iah_sensors:BME680: BME680 Climate Sensor Dimensions: 3.0 x 3.0 mm Pitch: 0.8 mm
U1501 = df4iah_powersupply:LM4120IM5-3.0: Precision Micropower Low Dropout Voltage Reference; MPN: LM4120IM5-3.0; OC_FARNELL: 1312745; OC_NEWARK: 41K5441; PACKAGE: SOT-23-5; SUPPLIER: National Semiconductors
U1511 = df4iah_dac:MAX5217: Maxim Integrated MAX5217 DAC DAC 16 bit, I2C
U1531 = df4iah_osc:CFPT-141: VCTCXO, 3.0V; MF: IQD-FREQUENCY-PRODUCTS; MPN: LFTVXO022175; OC_FARNELL: 1100745
U1541 = df4iah_opamp:OPA354: CMOS OPERATIONAL AMPLIFIERS; MPN: OPA354AIDBVT; OC_FARNELL: 1207050; OC_NEWARK: -; PACKAGE: SOT-23-5; SUPPLIER: Texas Instruments
U1542 U2541 = df4iah_opamp:LPV811: CMOS OPERATIONAL AMPLIFIERS; PACKAGE: SOT-23-5
U1601 = df4iah_osc:SI5338: SI5338 I2C-PROGRAMMABLE ANY-FREQUENCY, ANY-OUTPUT QUAD CLOCK GENERATOR
U1651 U2681 U2901 U3001 U3101 U3201 U3491 = df4iah_sc-switches:TS5A23166: TS5A23166 0.9-Ω Dual-SPST Analog Switch
U1701 = df4iah_adc:PCM1863: Texas Instruments PCM1863 4-Channel or 2-Channel, 192-kHz, Audio ADCs
U1801 = df4iah_dac:WM8523: WM8523 DAC, 2ch, 24 Bit, I2S, Control: I2C/SPI
U1901 = df4iah_gsm:SIM868: SIMCom SIM868 GSM/GPRS - GNSS Module Quad-band 850/900/1800/1900MHz GPRS multi-slot class 12/10 GPRS mobile station class B Support GPS/GLONASS/BD Dimensions: 17.6*15.7*2.3mm Weight: 1.5g Control via AT commands (3GPP TS 27.007, 27.005 and SIMComenhanced AT Commands) Supply voltage range 3.4 ~ 4.4V Low power consumption Operation temperature:-40℃~85℃ GNSS 33 tracking /99 acquisition channelSensitivity -Tracking: -167 dBm Reacquisition: -161 dBm Cold starts : -149 dBm
U2201 = df4iah_rf:SX1262: Semtech SX1261/2 Long Range, Low Power, sub-GHz RF Transceiver FRF = 434/490/868/915 MHz FXOSC = 32 MHz Synthesizer frequency range: 150 - 960 MHz Synthesizer frequency step: 0.95 Hz
U2271 = df4iah_rf:PE4259: pSemi PE4259 SPDT High Power UltraCMOS® 10 MHz–3.0 GHz RF Switch Low insertion loss: 0.35 dB @ 1000 MHz, 0.5 dB @ 2000 MHz Isolation of 30 dB @ 1000 MHz Typical input 1 dB compression point of +33.5 dBm 6-lead SC-70 package Reference: http://www.psemi.com/products/rf-switches/pe4259
U2301 = df4iah_rf:AX5243: AX5243 Advanced High Performance ASK and FSK Narrow-band Transceiver for 27 - 1050 MHz Range Reference: http://www.onsemi.com/PowerSolutions/product.do?id=AX5243
U2401 = df4iah_powersupply:LM53603-Q1: TI LM53603-Q1 3.5 V to 36 V Wide-VIN Synchronous 2.1 MHz Step- Down Converters for Automotive Applications
U2501 = df4iah_powersupply:BQ24193: TI BQ24193 I2C Controlled 4.5-A Single Cell USB/Adapter Charger with Narrow VDC Power Path Management and USB OTG
U2601 = df4iah_powersupply:BQ25570: TI BQ25570 Nano Power Boost Charger and Buck Converter for Energy Harvester Powered Applications
U2701 U2801 = df4iah_powersupply:TPS62743: TPS62743 300/400 mA High Efficiency Buck Converter with Ultra-low Quiescent Current Input Voltage Range VIN from 2.15 V to 5.5 V Input Voltage Range Down to 2.0 V Once Started Output Current TPS62743 300 mA TPS627431 400mA 360 nA Operational Quiescent Current Up to 90% Efficiency at 10-μA Output Current Power Save Mode Operation Selectable Output Voltages 8 voltage options between 1.2 V to 3.3 V Output Voltage Discharge Low Output Voltage Ripple Automatic Transition to No Ripple 100% Mode RF Friendly DCS-Control™ Total Solution Size <10mm2 Small 1.6 mm × 0.9 mm, 8 Ball WCSP Package
U3492 = df4iah_rf:TDK_B4310: TDK B4310 SAW-filter for GNSS Package size 1.4 x 1.1 x 0.4 mm3 Package code QCS5P RoHS compatible Approximate weight 0.003 g Package for Surface Mount Technology (SMT) Ni, gold-plated terminals AEC-Q200 qualified component family (operable temperature range –40°C to +85°C) Electrostatic Sensitive Device (ESD)
X0201 = df4iah_connector:2X05_1MM27_SHROUDED_CORTEX_JTAG_SWD: Header 2X5 1.27mm 0.05" shrouded - CORTEX JTAG-SWD SAMTEC FTSH-105-01-F-D-K HARWIN M50-3500542
X0221 = df4iah_connector:HEADER-1X2: Header 1X2 2.54mm
X1201 = df4iah_switch:TTE_EN11-HSM: TT-Electronics EN1-HSM Rotary Encoder with Switch
X1951 = df4iah_connector:MICROSIM-8P_SDCARD-8P_MOLEX-104642-1610: Mikro-SIM and Mikro-SD-Cardholder 8 pins and 8 pins; MPN: MOLEX-104642-1610; OC_FARNELL: 2545018
X1961 = df4iah_connector:HEADER-2X2: Header 2X2 2.54mm
X2411 X2601 = df4iah_connector:WIRE-TO-BOARD_5MM08_1X02: Wire-to-Board connector 5.08mm 1x02
X2551 = df4iah_connector:JST_S3B-XH-A: JST S3B-XH-A shrouded header 3 circuit connections with 2.500 mm pin spacing
X3301 = df4iah_connector:USB_MICRO-B_MOLEX: USB Type Micro-B Connector Male/female and PTH/SMT variants Molex Products: Micro-USB B Receptacle, Bottom Mount, Surface Mount, with Solder Tabs, Lead-Free <http://www.molex.com/molex/products/datasheet.jsp?part=active/1050170001_IO_CONNECTORS.xml>
X3401 X3411 X3471 X3481 X3491 = df4iah_connector:SMA_SMT_AMPHENOL-901-143: RF/COAXIAL, SMA JACK, R/A, 50OHM, THD; MPN: 901-143; OC_FARNELL: 1461631; OC_NEWARK: 51F3841; PACKAGE: RF/COAXIAL, SMA JACK, R/A, 50OHM, THD; SUPPLIER: Amphenol
X3501 X3511 = df4iah_connector:SJ1-353XNS_3MM5-STEREO-AUDIO-JACKS: SJ1-353XNS_3MM5-STEREO-AUDIO-JACKS
X3611 X3612 X3631 X3632 = df4iah_connector:2X20/90_1MM27_HARWIN_M50-3202045_SOCKET: Socket 20X2 1.27mm M50-3202045 Archer, 90°

## Net classes
1 pwr_relay: width 1.5 mm, clearance 0.5 mm
2 pwr_ttl: width 0.75 mm, clearance 0.5 mm
3 usb_pair: width 0.254 mm, clearance 0.152 mm
4 pwrA5: width 0.305 mm
5 single50R_1-2_15-16: width 0.33 mm, drill 0.305 mm, clearance 0.33 mm
6 single50R_2-3-14_14-15-16: width 0.279 mm, drill 0.305 mm, clearance 0.279 mm
7 +3V3: clearance 0.5 mm
8 GND: clearance 0.5 mm